# Altium project LimeSDR-X3_1v0.PrjPcb (part 1 of 19)
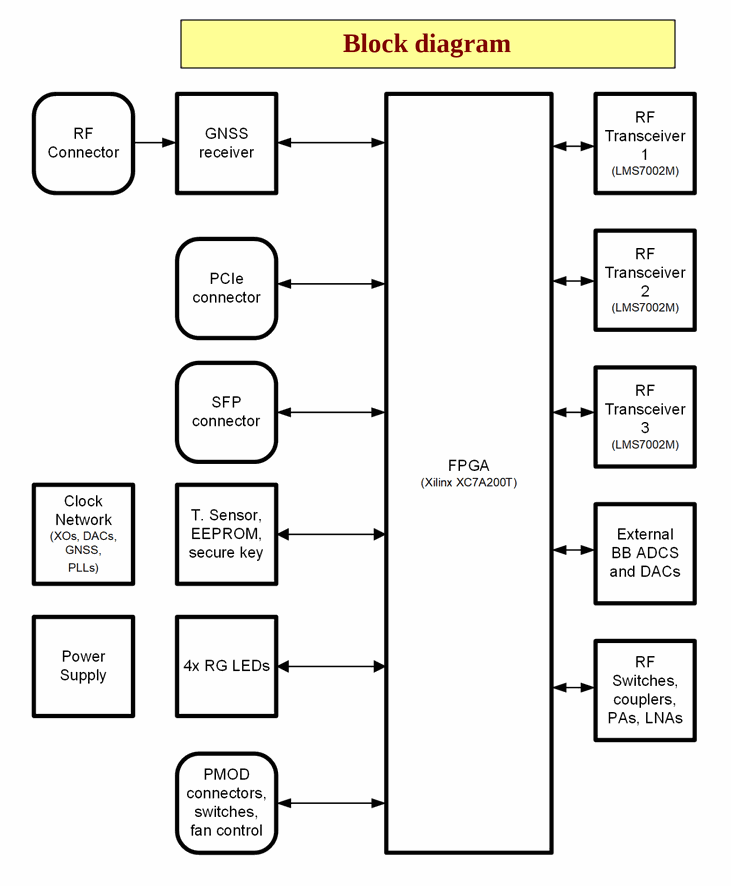
[diagram p0: 01_BlockDiagram.SchDoc]
31 sheets, 2073 parts. Net scope: global (net labels, ports and power ports of the same name join across sheets).
Board file: LimeSDR-X3_1v0.PcbDoc
Sheets:
  01_BlockDiagram.SchDoc
  02_PowerDiagram.SchDoc
  03_ClockDiagram.SchDoc
  04_RFDiagram.SchDoc
  05_LMS1_Misc.SchDoc
  06_LMS2_Misc.SchDoc
  07_LMS3_Misc.SchDoc
  08_LMS1_RF.SchDoc
  09_LMS2_RF.SchDoc
  10_LMS3_RF.SchDoc
  11_LMS1_Power.SchDoc
  12_LMS2_Power.SchDoc
  13_LMS3_Power.SchDoc
  14_LMS1_RF_PA.SchDoc
  15_LMS2_RF1_Misc.SchDoc
  16_LMS2_RF2_Misc.SchDoc
  17_FPGA_B12_B13_B14_B15.SchDoc
  18_FPGA_B16_B33_B34_B35.SchDoc
  19_FPGA_misc.SchDoc
  20_FPGA_Power.SchDoc
  21_Peripherals.SchDoc
  22_LMS2_TX_BB_DACs.SchDoc
  23_LMS2_RX1_BB_ADC.SchDoc
  24_LMS2_RX2_BB_ADC.SchDoc
  25_LMS3_RX1_BB_ADC.SchDoc
  26_LMS3_RX2_BB_ADC.SchDoc
  27_WR_PTP.SchDoc
  28_Clocks1.SchDoc
  29_Clocks2.SchDoc
  30_Power1.SchDoc
  31_Power2.SchDoc

## Sheet 01_BlockDiagram.SchDoc: Block diagram
size A4; Organization: Lime Microsystems; Address1: Surrey Tech Centre; Address2: Guildford GU2 7YG; Address3: Surrey; Address4: United Kingdom; Revision: v1.0; SheetNumber: 1; SheetTotal: 31

### Notes on the sheet
- Block diagram
- Project name:
- Title:
- Size:
- Date:
- A4
- Revision:
- Time:
- Sheet
- of
- File:

## Sheet 02_PowerDiagram.SchDoc: Power diagram
size A4; Organization: Lime Microsystems; Address1: Surrey Tech Centre; Address2: Guildford GU2 7YG; Address3: Surrey; Address4: United Kingdom; Revision: v1.0; SheetNumber: 2; SheetTotal: 31
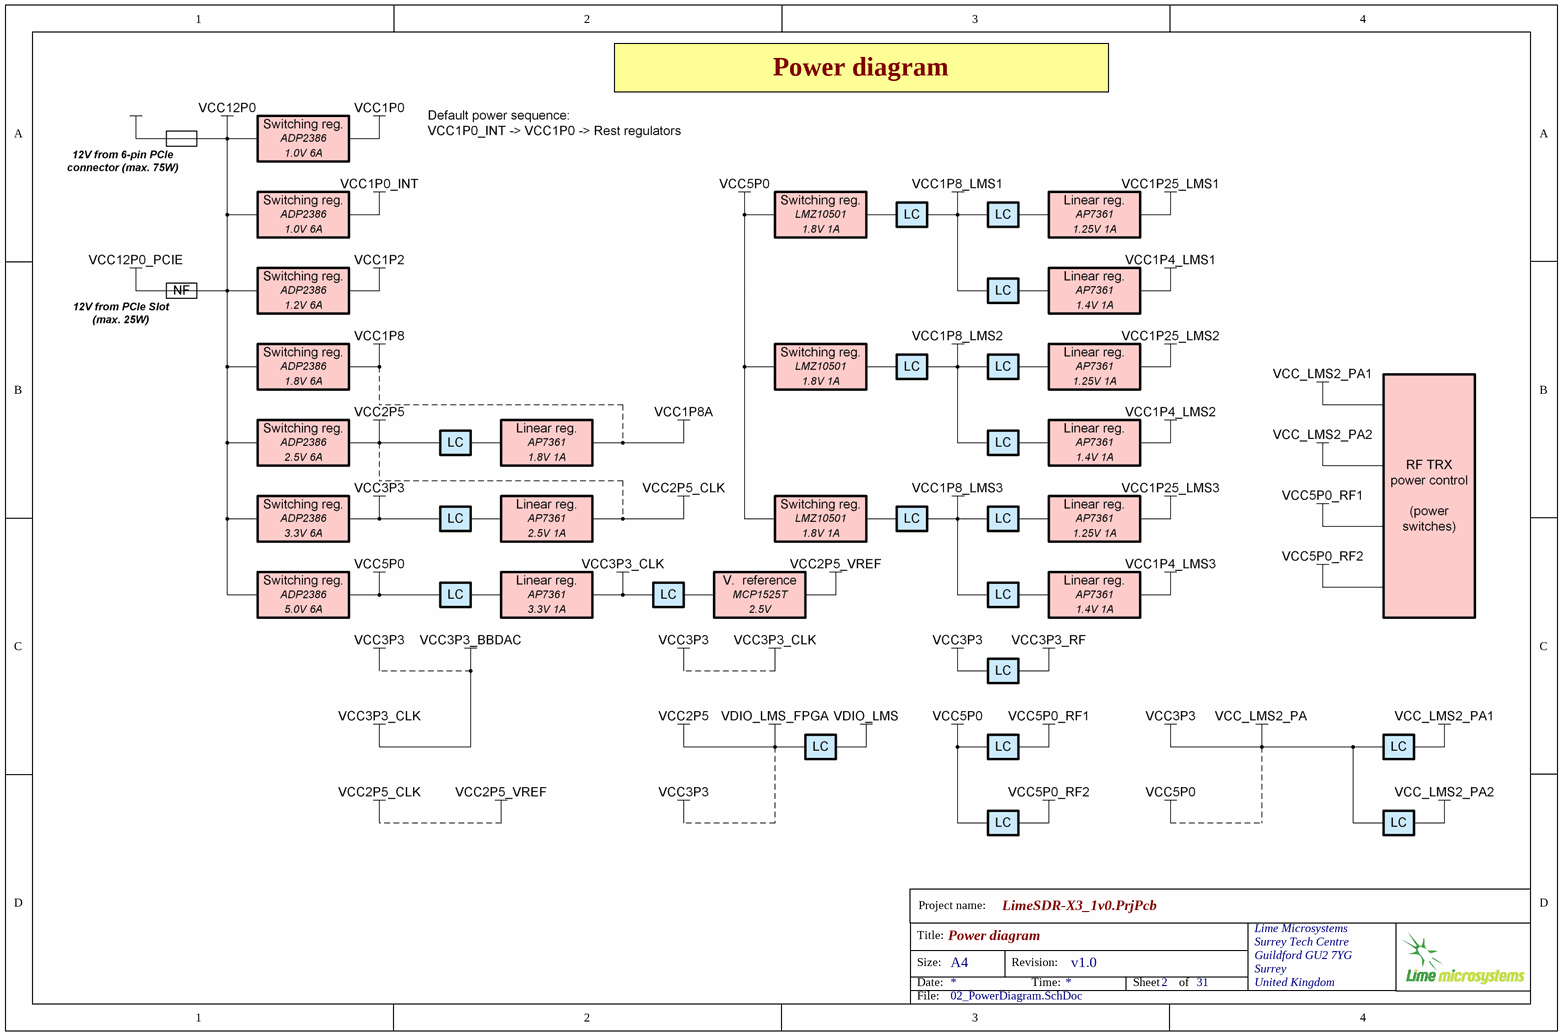
[diagram p1: 02_PowerDiagram.SchDoc]

### Notes on the sheet
- Power diagram
- Project name:
- Title:
- Size:
- Date:
- A4
- Revision:
- Time:
- Sheet
- of
- File:

## Sheet 03_ClockDiagram.SchDoc: Clock diagram
size A4; Organization: Lime Microsystems; Address1: Surrey Tech Centre; Address2: Guildford GU2 7YG; Address3: Surrey; Address4: United Kingdom; Revision: v1.0; SheetNumber: 3; SheetTotal: 31
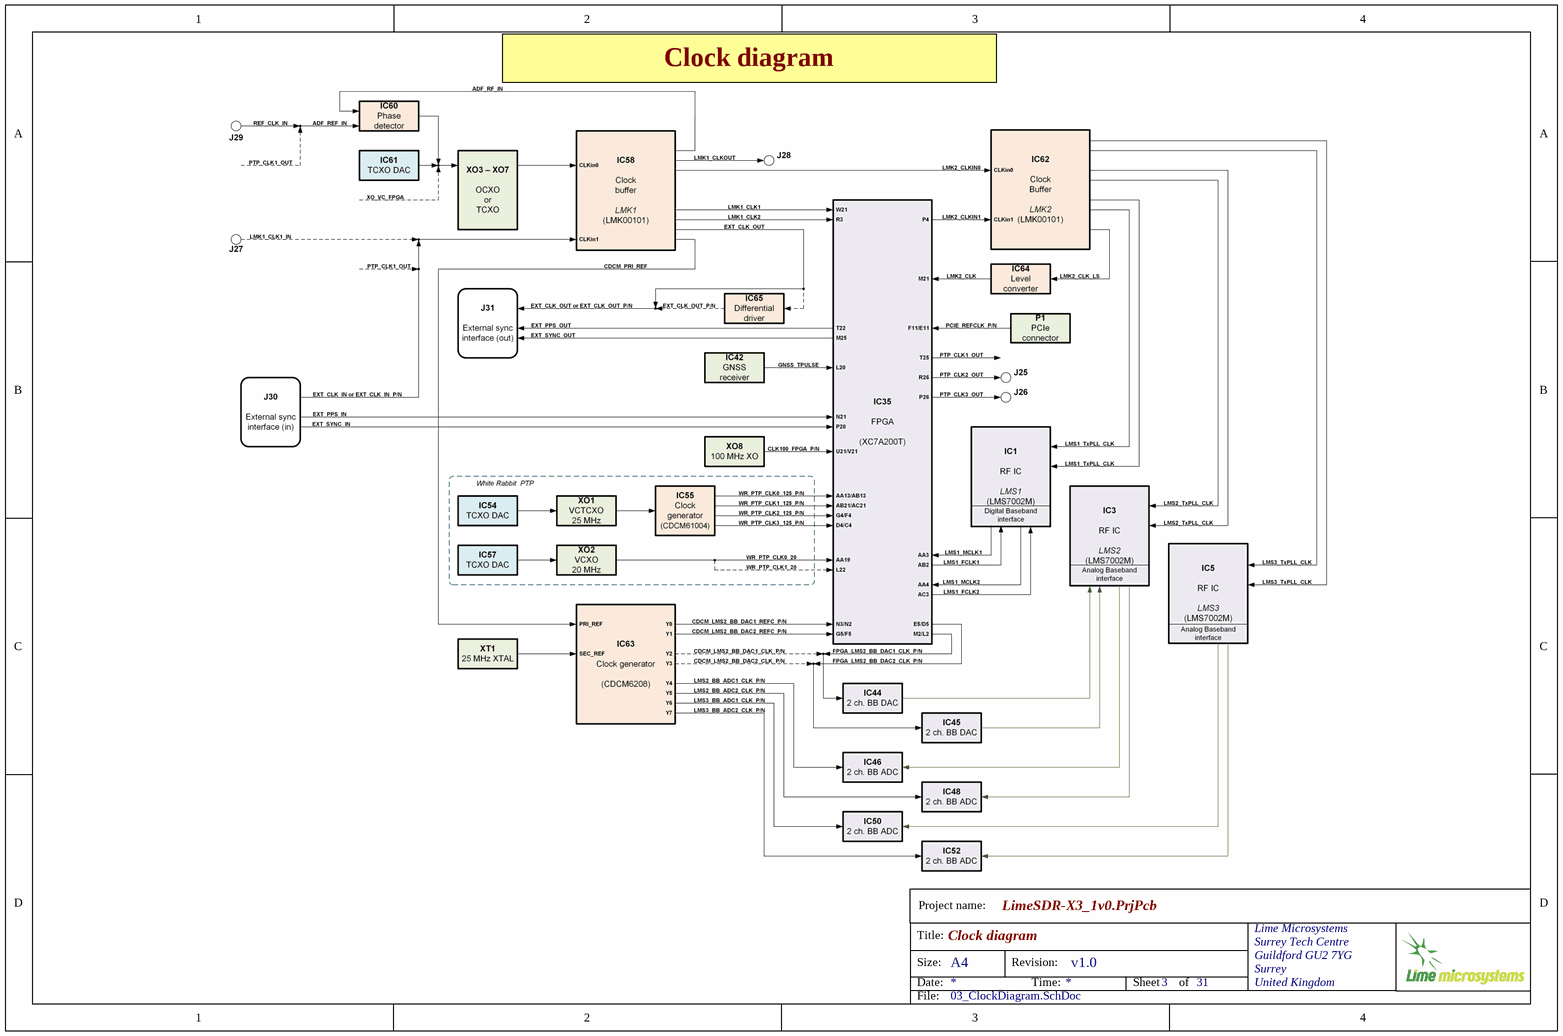
[diagram p2: 03_ClockDiagram.SchDoc]

### Notes on the sheet
- Clock diagram
- Project name:
- Title:
- Size:
- Date:
- A4
- Revision:
- Time:
- Sheet
- of
- File:

## Sheet 04_RFDiagram.SchDoc: RF diagram
size A4; Organization: Lime Microsystems; Address1: Surrey Tech Centre; Address2: Guildford GU2 7YG; Address3: Surrey; Address4: United Kingdom; Revision: v1.0; SheetNumber: 4; SheetTotal: 31
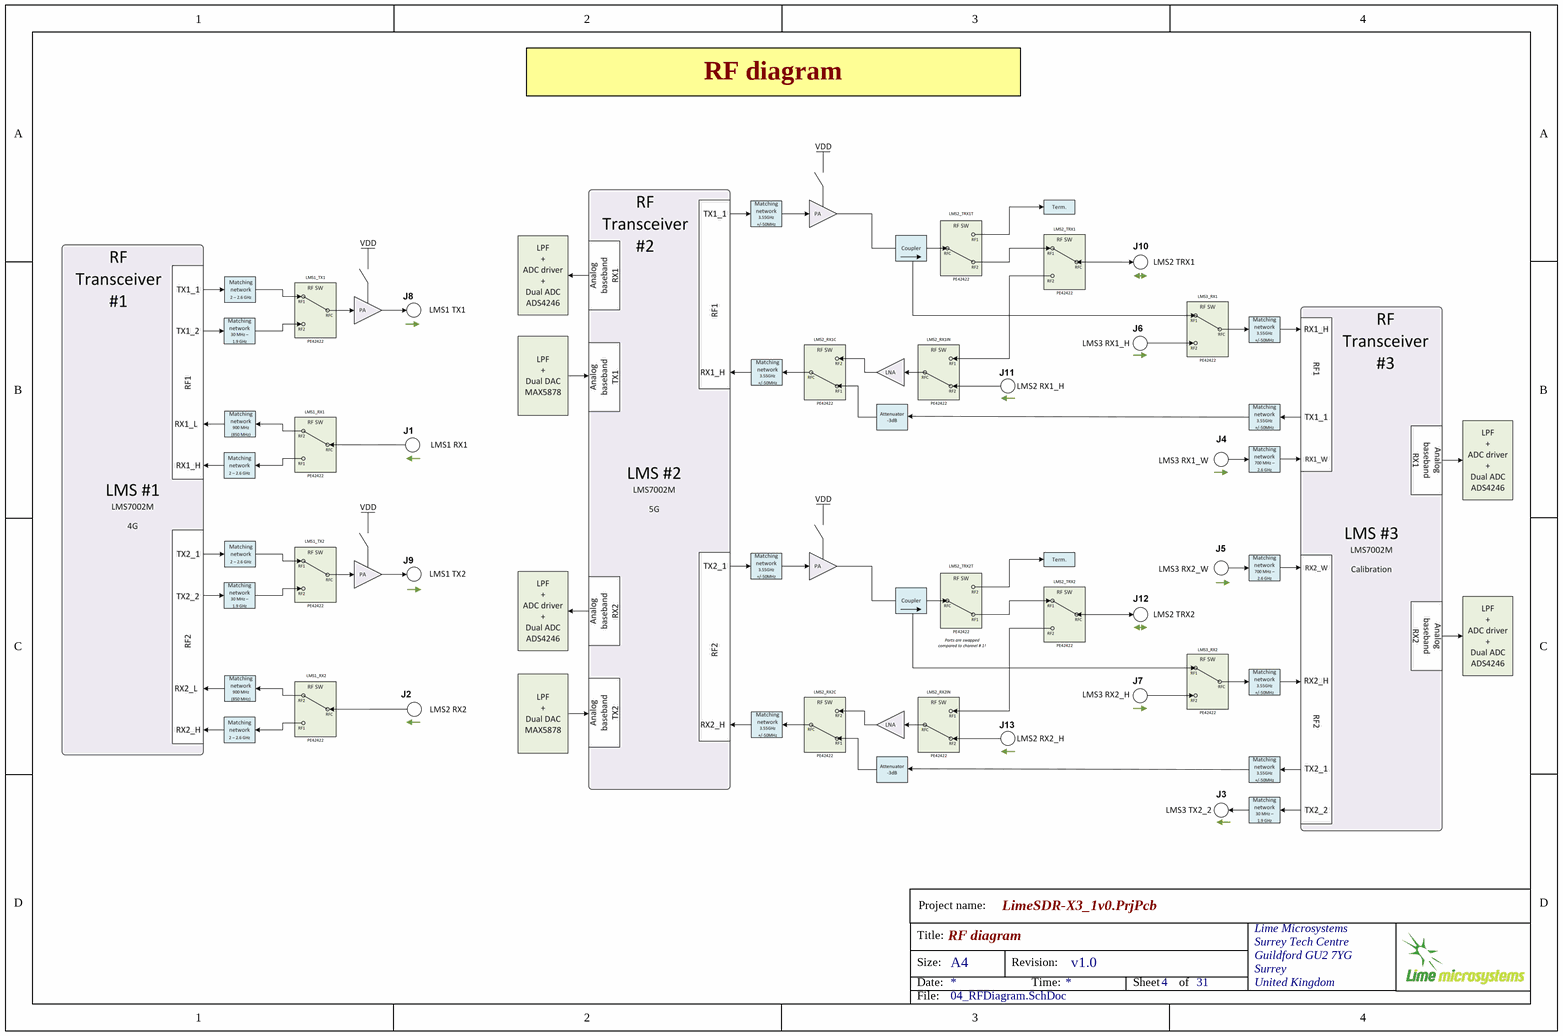
[diagram p3: 04_RFDiagram.SchDoc]

### Notes on the sheet
- RF diagram
- Project name:
- Title:
- Size:
- Date:
- A4
- Revision:
- Time:
- Sheet
- of
- File:

## Sheet 05_LMS1_Misc.SchDoc: LMS7002M misc (LMS1)
size A3; Organization: Lime Microsystems; Address1: Surrey Tech Centre; Address2: Guildford GU2 7YG; Address3: Surrey; Address4: United Kingdom; Revision: v1.0; SheetNumber: 5; SheetTotal: 31
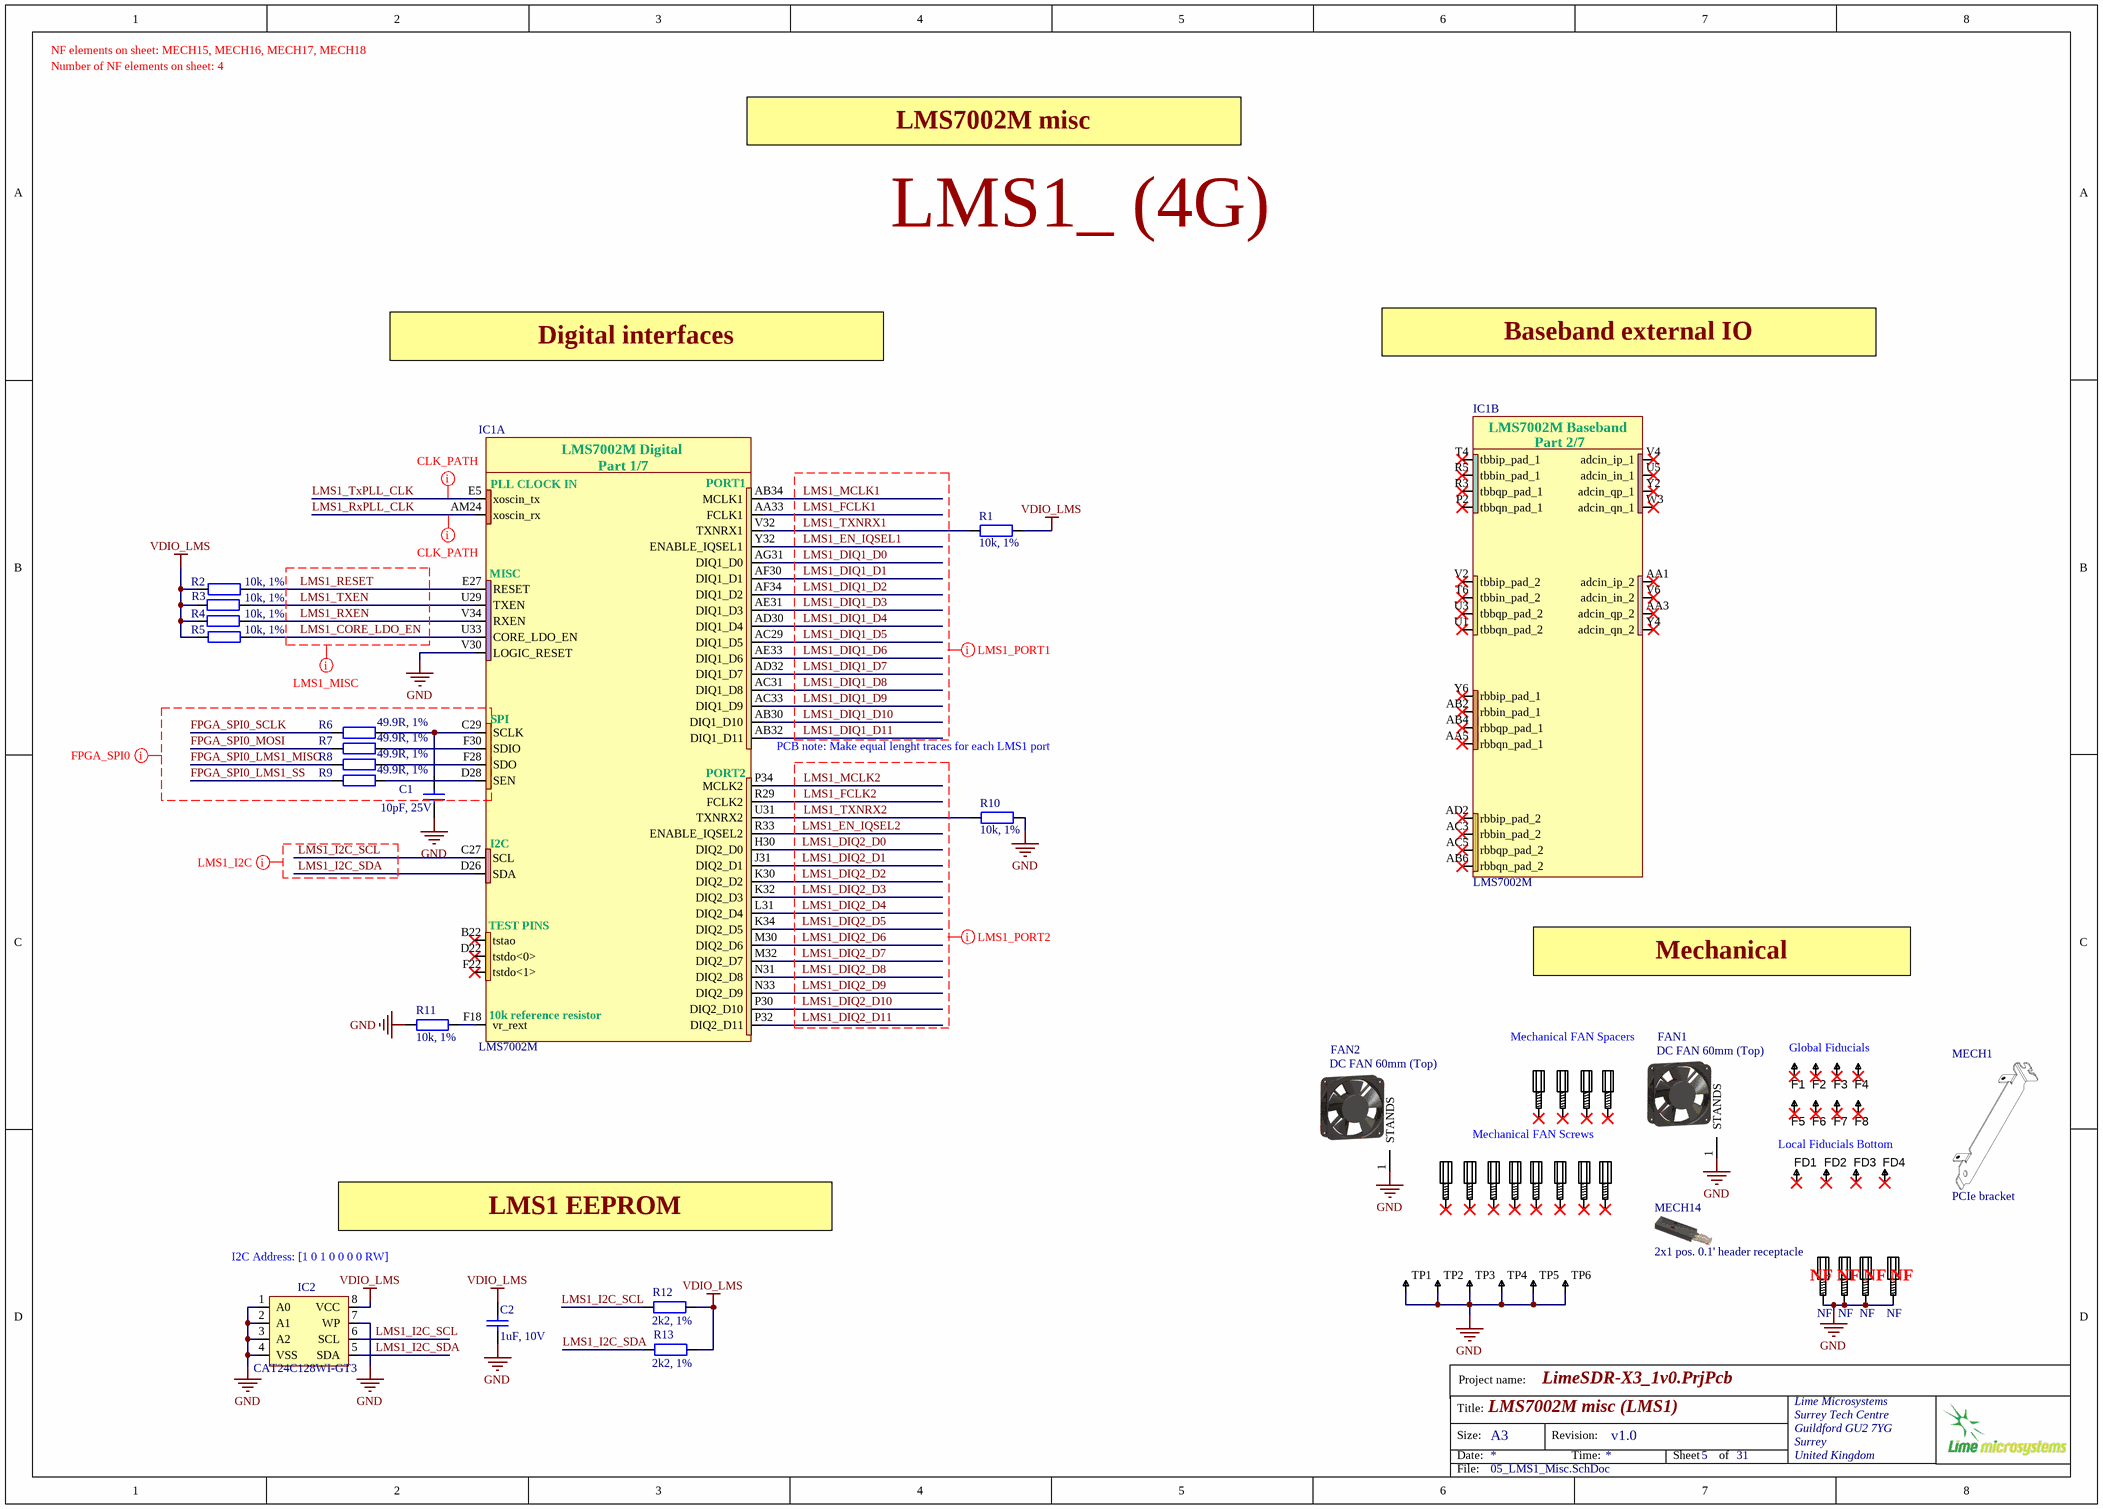
[diagram p4: 05_LMS1_Misc.SchDoc]

### Parts
C1  10pF, 25V  [CAP0402]
C2  1uF, 10V  [CAP0402]
F1  Fiducial  [Fiducial]  (value not drawn)
F2  Fiducial  [Fiducial]  (value not drawn)
F3  Fiducial  [Fiducial]  (value not drawn)
F4  Fiducial  [Fiducial]  (value not drawn)
F5  Fiducial  [Fiducial]  (value not drawn)
F6  Fiducial  [Fiducial]  (value not drawn)
F7  Fiducial  [Fiducial]  (value not drawn)
F8  Fiducial  [Fiducial]  (value not drawn)
FAN1  DC FAN 60mm (Top)  [FAN_60mm]
FAN2  DC FAN 60mm (Top)  [FAN_60mm]
FD1  Fiducial  [Fiducial_local]  (value not drawn)
FD2  Fiducial  [Fiducial_local]  (value not drawn)
FD3  Fiducial  [Fiducial_local]  (value not drawn)
FD4  Fiducial  [Fiducial_local]  (value not drawn)
IC1  LMS7002M  [LMS7002M_v5]  (parts A,B of 7)
IC2  CAT24C128WI-GT3  [SOIC127P600-8DL_v2]
MECH1  PCIe bracket  [PCIe_bracket]  (mechanical)
MECH2  Spacer M3  (value not drawn)  (mechanical)
MECH3  Spacer M3  (value not drawn)  (mechanical)
MECH4  Spacer M3  (value not drawn)  (mechanical)
MECH5  Spacer M3  (value not drawn)  (mechanical)
MECH6  Screws M3  (value not drawn)  (mechanical)
MECH7  Screws M3  (value not drawn)  (mechanical)
MECH8  Screws M3  (value not drawn)  (mechanical)
MECH9  Screws M3  (value not drawn)  (mechanical)
MECH10  Screws M3  (value not drawn)  (mechanical)
MECH11  Screws M3  (value not drawn)  (mechanical)
MECH12  Screws M3  (value not drawn)  (mechanical)
MECH13  Screws M3  (value not drawn)  (mechanical)
MECH14  2x1 pos. 0.1' header receptacle  (mechanical)
MECH15  Assembly Info: NF  [PCB_standoff]  (hidden comment: Standoff)
MECH16  Assembly Info: NF  [PCB_standoff]  (hidden comment: Standoff)
MECH17  Assembly Info: NF  [PCB_standoff]  (hidden comment: Standoff)
MECH18  Assembly Info: NF  [PCB_standoff]  (hidden comment: Standoff)
R1  10k, 1%  [RES0402]
R2  10k, 1%  [RES0402]
R3  10k, 1%  [RES0402]
R4  10k, 1%  [RES0402]
R5  10k, 1%  [RES0402]
R6  49.9R, 1%  [RES0402]
R7  49.9R, 1%  [RES0402]
R8  49.9R, 1%  [RES0402]
R9  49.9R, 1%  [RES0402]
R10  10k, 1%  [RES0402]
R11  10k, 1%  [RES0402]
R12  2k2, 1%  [RES0402]
R13  2k2, 1%  [RES0402]
TP1  TESTPOINT_THT_MINI  [TP-SMD-LOW_PROFILE]  (value not drawn)
TP2  TESTPOINT_THT_MINI  [TP-SMD-LOW_PROFILE]  (value not drawn)
TP3  TESTPOINT_THT_MINI  [TP-SMD-LOW_PROFILE]  (value not drawn)
TP4  TESTPOINT_THT_MINI  [TP-SMD-LOW_PROFILE]  (value not drawn)
TP5  TESTPOINT_THT_MINI  [TP-SMD-LOW_PROFILE]  (value not drawn)
TP6  TESTPOINT_THT_MINI  [TP-SMD-LOW_PROFILE]  (value not drawn)

### Nets
GND: C1.2 C2.2 FAN1.1(STANDS) FAN2.1(STANDS) IC1.V30(LOGIC_RESET) IC2.1(A0) IC2.2(A1) IC2.3(A2) IC2.4(VSS) IC2.7(WP) MECH15.MH1 MECH16.MH1 MECH17.MH1 MECH18.MH1 R10.1 R11.2 TP1.1 TP2.1 TP3.1 TP4.1 TP5.1 TP6.1
VDIO_LMS: C2.1 IC2.8(VCC) R1.2 R2.2 R3.1 R4.1 R5.2 R12.1 R13.1
FPGA_SPI0_LMS1_MISO: R8.2
FPGA_SPI0_LMS1_SS: R9.2
FPGA_SPI0_MOSI: R7.2
FPGA_SPI0_SCLK: R6.2
LMS1_CORE_LDO_EN: IC1.U33(CORE_LDO_EN) R5.1
LMS1_DIQ1_D0: IC1.AG31(DIQ1_D0)
LMS1_DIQ1_D1: IC1.AF30(DIQ1_D1)
LMS1_DIQ1_D2: IC1.AF34(DIQ1_D2)
LMS1_DIQ1_D3: IC1.AE31(DIQ1_D3)
LMS1_DIQ1_D4: IC1.AD30(DIQ1_D4)
LMS1_DIQ1_D5: IC1.AC29(DIQ1_D5)
LMS1_DIQ1_D6: IC1.AE33(DIQ1_D6)
LMS1_DIQ1_D7: IC1.AD32(DIQ1_D7)
LMS1_DIQ1_D8: IC1.AC31(DIQ1_D8)
LMS1_DIQ1_D9: IC1.AC33(DIQ1_D9)
LMS1_DIQ1_D10: IC1.AB30(DIQ1_D10)
LMS1_DIQ1_D11: IC1.AB32(DIQ1_D11)
LMS1_DIQ2_D0: IC1.H30(DIQ2_D0)
LMS1_DIQ2_D1: IC1.J31(DIQ2_D1)
LMS1_DIQ2_D2: IC1.K30(DIQ2_D2)
LMS1_DIQ2_D3: IC1.K32(DIQ2_D3)
LMS1_DIQ2_D4: IC1.L31(DIQ2_D4)
LMS1_DIQ2_D5: IC1.K34(DIQ2_D5)
LMS1_DIQ2_D6: IC1.M30(DIQ2_D6)
LMS1_DIQ2_D7: IC1.M32(DIQ2_D7)
LMS1_DIQ2_D8: IC1.N31(DIQ2_D8)
LMS1_DIQ2_D9: IC1.N33(DIQ2_D9)
LMS1_DIQ2_D10: IC1.P30(DIQ2_D10)
LMS1_DIQ2_D11: IC1.P32(DIQ2_D11)
LMS1_EN_IQSEL1: IC1.Y32(ENABLE_IQSEL1)
LMS1_EN_IQSEL2: IC1.R33(ENABLE_IQSEL2)
LMS1_FCLK1: IC1.AA33(FCLK1)
LMS1_FCLK2: IC1.R29(FCLK2)
LMS1_I2C_SCL: IC1.C27(SCL) IC2.6(SCL) R12.2
LMS1_I2C_SDA: IC1.D26(SDA) IC2.5(SDA) R13.2
LMS1_MCLK1: IC1.AB34(MCLK1)
LMS1_MCLK2: IC1.P34(MCLK2)
LMS1_RESET: IC1.E27(RESET) R2.1
LMS1_RXEN: IC1.V34(RXEN) R4.2
LMS1_RxPLL_CLK: IC1.AM24(xoscin_rx)
LMS1_TXEN: IC1.U29(TXEN) R3.2
LMS1_TXNRX1: IC1.V32(TXNRX1) R1.1
LMS1_TXNRX2: IC1.U31(TXNRX2) R10.2
LMS1_TxPLL_CLK: IC1.E5(xoscin_tx)
NetC1_1: C1.1 IC1.C29(SCLK) R6.1
NetIC1_D28: IC1.D28(SEN) R9.1
NetIC1_F18: IC1.F18(vr_rext) R11.1
NetIC1_F28: IC1.F28(SDO) R8.1
NetIC1_F30: IC1.F30(SDIO) R7.1

Not connected (* = marked no-connect by the designer): F1 1*; F2 1*; F3 1*; F4 1*; F5 1*; F6 1*; F7 1*; F8 1*; FD1 1*; FD2 1*; FD3 1*; FD4 1*; IC1 AA1(adcin_ip_2)* AA3(adcin_qp_2)* AA5(rbbqn_pad_1)* AB2(rbbin_pad_1)* AB4(rbbqp_pad_1)* AB6(rbbqn_pad_2)* AC3(rbbin_pad_2)* AC5(rbbqp_pad_2)* AD2(rbbip_pad_2)* B22(tstao)* D22(tstdo<0>)* F22(tstdo<1>)* P2(tbbqn_pad_1)* R3(tbbqp_pad_1)* R5(tbbin_pad_1)* T4(tbbip_pad_1)* T6(tbbin_pad_2)* U1(tbbqn_pad_2)* U3(tbbqp_pad_2)* U5(adcin_in_1)* V2(tbbip_pad_2)* V4(adcin_ip_1)* V6(adcin_in_2)* W3(adcin_qn_1)* Y2(adcin_qp_1)* Y4(adcin_qn_2)* Y6(rbbip_pad_1)*; MECH2 MH1*; MECH3 MH1*; MECH4 MH1*; MECH5 MH1*; MECH6 MH1*; MECH7 MH1*; MECH8 MH1*; MECH9 MH1*; MECH10 MH1*; MECH11 MH1*; MECH12 MH1*; MECH13 MH1*

### Layout directives
net class CLK_PATH: LMS1_RxPLL_CLK, LMS1_TxPLL_CLK
net class FPGA_SPI0: FPGA_SPI0_LMS1_MISO, FPGA_SPI0_LMS1_SS, FPGA_SPI0_MOSI, FPGA_SPI0_SCLK
net class LMS1_I2C: LMS1_I2C_SCL, LMS1_I2C_SDA
net class LMS1_PORT2: LMS1_DIQ2_D0, LMS1_DIQ2_D1, LMS1_DIQ2_D2, LMS1_DIQ2_D3, LMS1_DIQ2_D4, LMS1_DIQ2_D5, LMS1_DIQ2_D6, LMS1_DIQ2_D7, LMS1_DIQ2_D8, LMS1_DIQ2_D9, LMS1_DIQ2_D10, LMS1_DIQ2_D11, LMS1_EN_IQSEL2, LMS1_FCLK2, LMS1_MCLK2, LMS1_TXNRX2
net class LMS1_PORT1: LMS1_DIQ1_D0, LMS1_DIQ1_D1, LMS1_DIQ1_D2, LMS1_DIQ1_D3, LMS1_DIQ1_D4, LMS1_DIQ1_D5, LMS1_DIQ1_D6, LMS1_DIQ1_D7, LMS1_DIQ1_D8, LMS1_DIQ1_D9, LMS1_DIQ1_D10, LMS1_DIQ1_D11, LMS1_EN_IQSEL1, LMS1_FCLK1, LMS1_MCLK1, LMS1_TXNRX1
net class LMS1_MISC: LMS1_CORE_LDO_EN, LMS1_RESET, LMS1_RXEN, LMS1_TXEN

### Notes on the sheet
- NF elements on sheet: MECH15, MECH16, MECH17, MECH18
- Number of NF elements on sheet: 4
- LMS7002M misc
- LMS1_ (4G)
- Digital interfaces
- Baseband external IO
- (near IC1) PCB note: Make equal lenght traces for each LMS1 port
- Mechanical
- Mechanical FAN Spacers
- Global Fiducials
- Mechanical FAN Screws
- Local Fiducials Bottom
- (near IC2) I2C Address: [1 0 1 0 0 0 0 RW]
- LMS1 EEPROM
- NF
- Project name:
- Title:
- Size:
- Date:
- A3
- Revision:
- Time:
- Sheet
- of
- File:
- (in symbol LMS7002Mr4, part A) LMS7002M Digital; Part 1/7; PLL CLOCK IN; PORT1; MISC; SPI; PORT2; I2C; TEST PINS; 10k reference resistor
- (in symbol LMS7002Mr4, part B) LMS7002M Baseband; Part 2/7

### Library data of the parts
C1 = Cap_0402: Manufacturer Part Number 1: 04023A100JAT2A; Manufacturer: AVX; Part Description: 10pF ±5% 25V C0G, NP0 Ceramic Capacitor -55°C ~ 125°C Surface Mount, MLCC 0402 (1005 Metric) 0.039" L x 0.020" W (1.00mm x 0.50mm); Capacitance Tolerance: ± 5%; Voltage Rating: 25; Ceramic Capacitor Case: 0402 [1005 Metric]; Capacitor Case Style: 0402 [1005 Metric]<!--FANDB--><div class="features-and-benefits-container"></div>; Dielectric Characteristic: C0G / NP0; SVHC: No SVHC (16-Jun-2014); Capacitance: 10; Value: 10pF, 25V; Supplier 1: Farnell; Supplier Part Number 1: 2332478RL; Product Range: -; RoHS: YES; Operating Temperature Min: -55; Operating Temperature Max: 125; Capacitance Tolerance ±: ± 5%; MSL: MSL 1 - Unlimited; Packaging: Cut Tape
C2 = Cap_0402: Manufacturer Part Number 1: C1005X5R1E105K050BC; Manufacturer: TDK; Part Description: 1µF ±10% 10V X5R Ceramic Capacitor -55°C ~ 85°C Surface Mount, MLCC 0402 (1005 Metric) 0.039" L x 0.020" W (1.00mm x 0.50mm); Voltage Rating: 10; Capacitance Tolerance: ± 10%; Product Range: TDK - C Series; Ceramic Capacitor Case: 0402 [1005 Metric]; Capacitance: 1; Dielectric Characteristic: X6; Value: 1uF, 10V; Supplier 1: Digi-Key; Supplier Part Number 1: 445-9066-1-ND; MSL: -; RoHS: YES
FAN1 FAN2 = 12V_DC_FAN: Part Description: Fan Tubeaxial 12VDC Square - 60mm L x 60mm H Vapo-Bearing™ 12.7 CFM (0.356m³/min) 2 Wire Leads; Manufacturer: Sunon; Manufacturer Part Number 1: HA60151V4-1000U-A99; ComponentLink1URL: http://www.orionfans.com/media/parts/dcfans/OD6025%20Final.pdf; ComponentLink1Description: http://www.orionfans.com/media/parts/dcfans/OD6025%20Final.pdf; Supplier 1: Digi-Key; Supplier Part Number 1: 259-1792-ND; Stock 1: 93; Pricing 1: 1=6,04000, 10=5,53300, 25=5,03000, 50=4,65260, 100=4,14960, 250=3,96096, 500=3,70948 (USD); RoHS: Yes; ComponentLink2URL: http://www.sunon.com/uFiles/file/03_products/08-catalog%20download/Sunon%20DC%20Brushless%20Fan%20&amp;%20Blower_(240-E).pdf?src-supplier=Digi-Key; ComponentLink2Description: http://www.sunon.com/uFiles/file/03_products/08-catalog%20download/Sunon%20DC%20Brushless%20Fan%20&amp;%20Blower_(240-E).pdf?src-supplier=Digi-Key
IC1 = LMS7002Mr4: Schematic symbol revision 4. Default footprint - 0.31mm pad; Manufacturer: Lime Microsystems; Part Description: IC FPRF Transceiver LMS7002M; 261 pin aQFN; Supplier 1: Lime Microsystems; Supplier Part Number 1: LMS7002M; Manufacturer Part Number 1: LMS7002M
IC2 = 24FC64F: Part Description: EEPROM Memory IC 128Kb (16K x 8) I²C 1MHz 400ns 8-SOIC; Manufacturer: ON Semiconductor; Memory Type: Non-Volatile; Memory Format: EEPROM; Memory Size: 128Kb (16K x 8); Write Cycle Time - Word, Page: 5ms; Memory Interface: I²C; Voltage - Supply: 1.8 V ~ 5.5 V; Supplier 1: Digi-Key; Supplier Part Number 1: CAT24C128WI-GT3CT-ND; Manufacturer Part Number 1: CAT24C128WI-GT3; RoHS: RoHS Compliant; Category: Integrated Circuits (ICs); Stock 1: 14804; Pricing 1: 1=0.31, 10=0.309, 100=0.2532, 500=0.24616, 1000=0.23956 (USD); Packaging: Cut Tape (CT); Part Status: Active; Technology: EEPROM; Operating Temperature: -40°C ~ 85°C (TA); Mounting Type: Surface Mount; Package / Case: 8-SOIC (0.154", 3.90mm Width); Supplier Device Package: 8-SOIC; Base Part Number: CAT24C128; ComponentLink1URL: http://www.onsemi.com/pub/Collateral/CAT24C128-D.PDF; ComponentLink1Description: http://www.onsemi.com/pub/Collateral/CAT24C128-D.PDF
MECH1 = PCIe_bracket: Part Description: BRACKET COMPUTER EISA/ISA OR PCI; Manufacturer: Keystone Electronics; Manufacturer Part Number 1: 9200; Body Material: Steel; ComponentLink1URL: http://www.keyelco.com/product-pdf.cfm?p=2468; ComponentLink1Description: http://www.keyelco.com/product-pdf.cfm?p=2468; Supplier 1: Digi-Key; Supplier Part Number 1: 36-9200-ND; Stock 1: 36909; Pricing 1: 1=2,08000, 10=1,88700, 50=1,69400, 250=1,46300, 1000=1,34000, 2500=1,16000, 5000=1,02410 (USD); RoHS: Yes; Mount: Brackets; Material: Steel; Package Quantity: 1; Packaging: Bulk; Length: 120.02mm; Width: 0.725inch; REACH SVHC: No SVHC; ComponentLink2URL: https://datasheet.ciiva.com/1624/88095-1624695.pdf?src-supplier=Element14; ComponentLink2Description: https://datasheet.ciiva.com/1624/88095-1624695.pdf?src-supplier=Element14; ComponentLink3URL: https://datasheet.ciiva.com/4667/9200-292546-4667239.pdf?src-supplier=Mouser; ComponentLink3Description: https://datasheet.ciiva.com/4667/9200-292546-4667239.pdf?src-supplier=Mouser; ComponentLink4URL: https://datasheet.ciiva.com/18415/70183120-18415751.pdf?src-supplier=Allied+Electronics; ComponentLink4Description: https://datasheet.ciiva.com/18415/70183120-18415751.pdf?src-supplier=Allied+Electronics
MECH2-MECH5 = STANDOFF_M-F_THREADED_M3x8x10mm_HEX_5mm dia: STANDOFF M/F MET 5MM HEX 10MM L; Manufacturer: BOSSARD; Manufacturer Part Number 1: TDYSFF-M3/10; Part Description: Screwed spacer sleeve; Int.thread: M3; 25mm; brass; Supplier 1: TME; Supplier Part Number 1: TDYSFF-M3/10
MECH6-MECH13 = STANDOFF_M-F_THREADED_M3x8x10mm_HEX_5mm dia: STANDOFF M/F MET 5MM HEX 10MM L; Manufacturer: BOSSARD; Manufacturer Part Number 1: 1003755; Part Description: Screw; M3x6; DIN:912; Head: cheese head; imbus; steel; zinc; Supplier 1: TME; Supplier Part Number 1: 1003755
MECH14 = Header_1x2_receptacle: Part Description: 2 Position Rectangular Receptacle Connector IDC Gold 24 AWG; Manufacturer: Molex; Manufacturer Part Number 1: 0014562021; Contact Resistance: 15mR; Max Voltage Rating (DC): 250.25kV; Current Rating: 3A; Voltage Rating: 250V; Connector Type: Receptacle,Socket,IDC; Number of Positions: 2; Wire/Cable Type: Discrete,Ribbon; Wire/Cable Gauge: 24AWG; Pitch: 2.54mm; Glow Wire Compliant: Non-compliant; Supplier 1: Digi-Key; Supplier Part Number 1: 23-0014562021-ND; Stock 1: 5637; Pricing 1: 2=0,78000, 10=0,68600, 26=0,64577, 50=0,61880, 100=0,59180, 250=0,53800, 500=0,48420, 1000=0,43040, 2500=0,39005 (USD); RoHS: Yes; Mount: Free Hanging,Cable; Contact Plating: Gold; Contact Material: Bronze; Color: Black; Housing Color: Black; Housing Material: Polyester; Min Operating Temperature: -40°C; Max Operating Temperature: 105°C; Number of Rows: 1; Contact Gender: Female; Package Quantity: 1; Packaging: Rail/Tube; Termination: IDT; Number of Contacts: 2; Orientation: Straight; Number of Circuits: 2; Length: 5.05mm; Height: 15.2mm; Width: 2.51mm; Lead Free: Lead Free; ComponentLink1URL: https://datasheet.ciiva.com/5162/0014562021-rb-cbl-wr-trp-conn-156807-5162409.pdf?src-supplier=Mouser; ComponentLink1Description: https://datasheet.ciiva.com/5162/0014562021-rb-cbl-wr-trp-conn-156807-5162409.pdf?src-supplier=Mouser; ComponentLink2URL: https://datasheet.ciiva.com/702/014562021-sd-702522.pdf?src-supplier=Digi-Key; ComponentLink2Description: https://datasheet.ciiva.com/702/014562021-sd-702522.pdf?src-supplier=Digi-Key; ComponentLink3URL: https://datasheet.ciiva.com/30109/85530014562021-rb-cbl-wr-trp-n-30109738.pdf?src-supplier=Onlinecomponents.com; ComponentLink3Description: https://datasheet.ciiva.com/30109/85530014562021-rb-cbl-wr-trp-n-30109738.pdf?src-supplier=Onlinecomponents.com
MECH15-MECH18 = STANDOFF_M-F_THREADED_M3x8x10mm_HEX_5mm dia: STANDOFF M/F MET 5MM HEX 10MM L; Manufacturer: FIX&FASTEN; Manufacturer Part Number 1: FIX-MAE-5TV; Part Description: PCB distance; polyamide; L:5mm; Colour: natural; Øcutout:3mm; Unit: pcs; SuppliedAmount: 1000; MinAmount: 10; Type of spacer: PCB distance; Panel cutout diameter: 3mm; Spanner size: 5.5mm; Internal thread: M3; Thread pitch: 0,5; Supplier 1: TME; Supplier Part Number 1: FIX-MAE-5TV; Category: Plastic Pegs; Weight: 0.145; Multiples: 10; Material: polyamide; Spacer length: 5mm; Price Type: NET
R1-R5 R10 R11 = Res_0402: Manufacturer: Yageo; Manufacturer Part Number 1: RC0402FR-0710KL; Part Description: RES SMD 10K OHM 1% 1/16W 0402; Temperature Coefficient: ±100ppm/°C; Power (Watts): 0.063W, 1/16W; Value: 10k, 1%; Supplier 1: Digi-Key; Supplier Part Number 1: 311-10.0KLRTR-ND; Resistance (Ohms): 10k; Packaging: Tape & Reel (TR); RoHS: RoHS Compliant; Package / Case: 0402 (1005 Metric); Tolerance: ±1%; Operating Temperature: -55°C ~ 155°C; Size / Dimension: 0.039" L x 0.020" W (1.00mm x 0.50mm); Number of Terminations: 2; Category: Resistors; Height: 0.016" (0.40mm); Supplier Device Package: 0402; Features: Moisture Resistant; Composition: Thick Film
R6-R9 = Res_0402: Manufacturer: Samsung Electro-Mechanics America, Inc.; Manufacturer Part Number: RC1005F49R9CS; Part Description: RES SMD 49.9 OHM 1% 1/16W 0402; Temperature Coefficient: ±100ppm/°C; Resistance (Ohms): 49.9; Power (Watts): 0.063W, 1/16W; Number of Terminations: 2; Size / Dimension: 0.039" L x 0.020" W (1.00mm x 0.50mm); Supplier Device Package: 0402 (1005 Metric); RoHS: RoHS Compliant; Supplier Part Number 1: 1276-3469-6-ND; Features: -; Packaging: Digi-Reel®; Tolerance: ±1%; Height: 0.016" (0.40mm); Category: Resistors; Composition: Thick Film; Package / Case: 0402 (1005 Metric); Supplier 1: Digi-Key; Operating Temperature: -55°C ~ 155°C; Value: 49.9R, 1%; Manufacturer Part Number 1: RC1005F49R9CS
R12 R13 = Res_0402: Manufacturer: Stackpole Electronics Inc; Manufacturer Part Number 1: RMCF0402FT2K20; Part Description: RES SMD 2.2K OHM 1% 1/16W 0402; Resistance (Ohms): 2.2k; Temperature Coefficient: ±100ppm/°C; Power (Watts): 0.063W, 1/16W; Value: 2k2, 1%; Supplier 1: Digi-Key; Supplier Part Number 1: RMCF0402FT2K20CT-ND; Supplier Device Package: 0402; Package / Case: 0402 (1005 Metric); Size / Dimension: 0.039" L x 0.020" W (1.00mm x 0.50mm); Operating Temperature: -55°C ~ 155°C; Composition: Thick Film; Category: Resistors; Features: -; Height: 0.016" (0.40mm); RoHS: RoHS Compliant; Number of Terminations: 2; Packaging: Cut Tape (CT); Tolerance: ±1%
TP1-TP6 = TESTPOINT_THT_MINI: Test Point PCB mount Miniature White; Manufacturer Part Number 1: S1751-46R; Manufacturer: Harwin Inc; Part Description: Natural PC Test Point 0.128" x 0.065" x 0.079" (3.25mm x 1.65mm x 2.00mm) Brass, Tin Plating Surface Mount Mounting Type; Supplier 1: Digi-Key; Supplier Part Number 1: 952-1478-2-ND; RoHS: RoHS Compliant; Color: Natural; Material: Copper Alloy; Mounting Type: Surface Mount; Terminal: 0.128" x 0.065" x 0.079" (3.25mm x 1.65mm x 2.00mm) Brass, Tin Plated; Type: PC Test Point; Packaging: Tape & Reel (TR); Category: Test and Measurement

## Sheet 06_LMS2_Misc.SchDoc: LMS7002M misc (LMS2)
size A3; Organization: Lime Microsystems; Address1: Surrey Tech Centre; Address2: Guildford GU2 7YG; Address3: Surrey; Address4: United Kingdom; Revision: v1.0; SheetNumber: 6; SheetTotal: 31
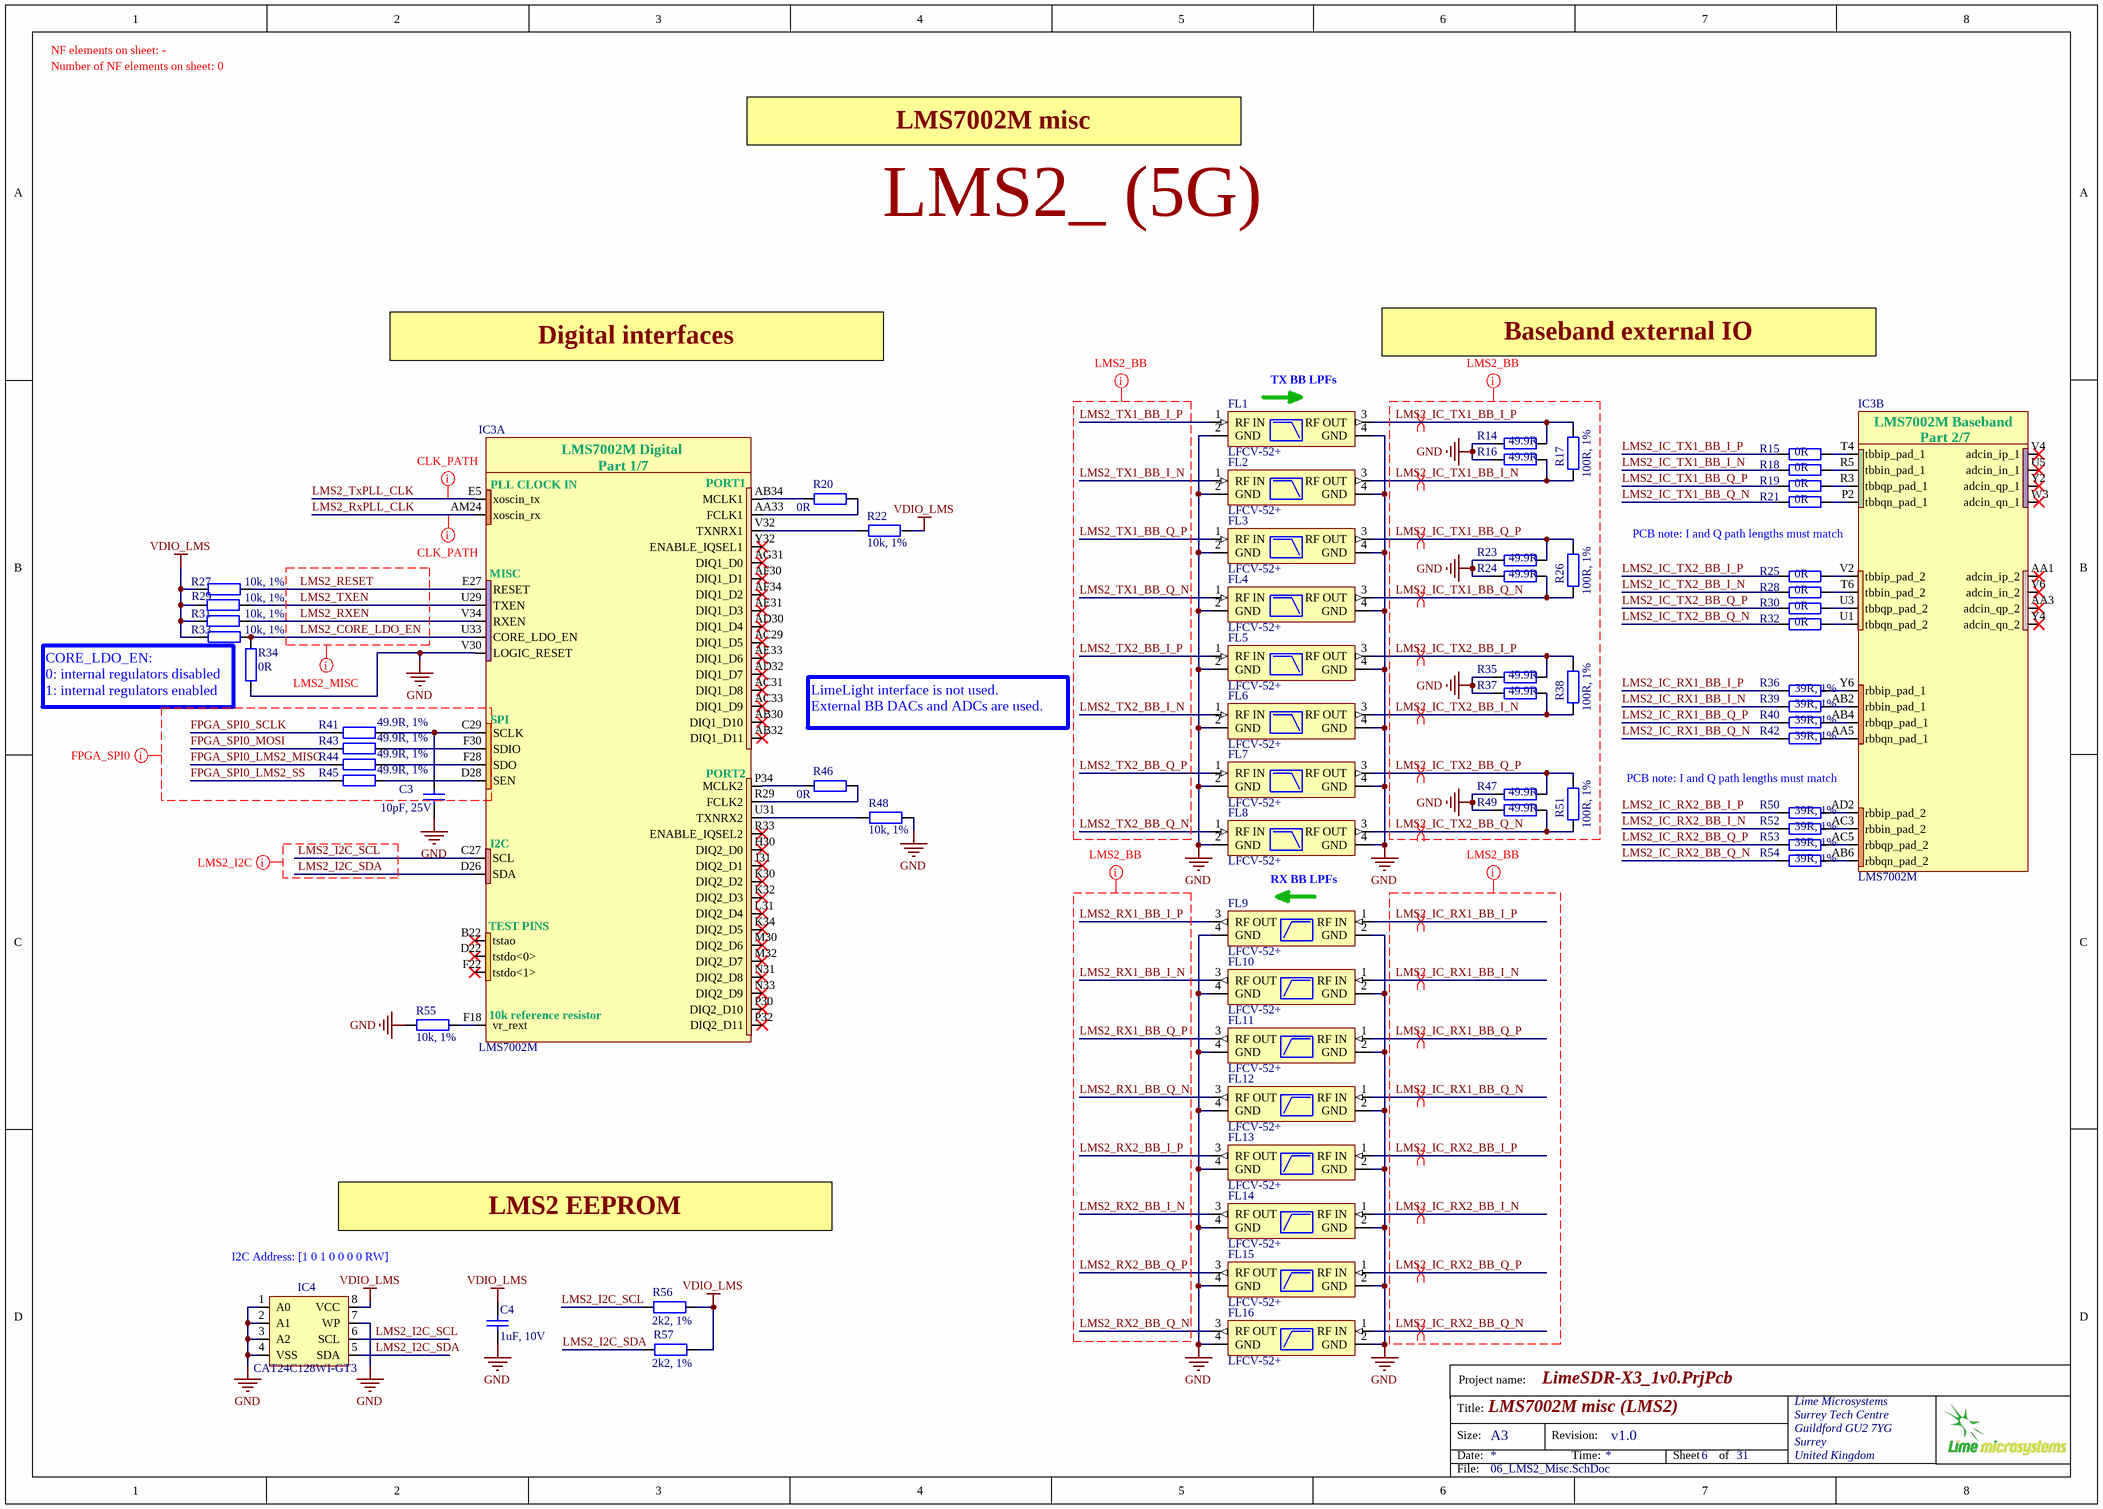
[diagram p5: 06_LMS2_Misc.SchDoc]

### Parts
C3  10pF, 25V  [CAP0402]
C4  1uF, 10V  [CAP0402]
FL1  LFCV-52+  [LFCV-52+_LPF_v2]
FL2  LFCV-52+  [LFCV-52+_LPF_v2]
FL3  LFCV-52+  [LFCV-52+_LPF_v2]
FL4  LFCV-52+  [LFCV-52+_LPF_v2]
FL5  LFCV-52+  [LFCV-52+_LPF_v2]
FL6  LFCV-52+  [LFCV-52+_LPF_v2]
FL7  LFCV-52+  [LFCV-52+_LPF_v2]
FL8  LFCV-52+  [LFCV-52+_LPF_v2]
FL9  LFCV-52+  [LFCV-52+_LPF_v2]
FL10  LFCV-52+  [LFCV-52+_LPF_v2]
FL11  LFCV-52+  [LFCV-52+_LPF_v2]
FL12  LFCV-52+  [LFCV-52+_LPF_v2]
FL13  LFCV-52+  [LFCV-52+_LPF_v2]
FL14  LFCV-52+  [LFCV-52+_LPF_v2]
FL15  LFCV-52+  [LFCV-52+_LPF_v2]
FL16  LFCV-52+  [LFCV-52+_LPF_v2]
IC3  LMS7002M  [LMS7002M_v5]  (parts A,B of 7)
IC4  CAT24C128WI-GT3  [SOIC127P600-8DL_v2]
R14  49.9R  [RES0402]
R15  0R  [RES0402]
R16  49.9R  [RES0402]
R17  100R, 1%  [RES0402]
R18  0R  [RES0402]
R19  0R  [RES0402]
R20  0R  [RES0402]
R21  0R  [RES0402]
R22  10k, 1%  [RES0402]
R23  49.9R  [RES0402]
R24  49.9R  [RES0402]
R25  0R  [RES0402]
R26  100R, 1%  [RES0402]
R27  10k, 1%  [RES0402]
R28  0R  [RES0402]
R29  10k, 1%  [RES0402]
R30  0R  [RES0402]
R31  10k, 1%  [RES0402]
R32  0R  [RES0402]
R33  10k, 1%  [RES0402]
R34  0R  [RES0402]
R35  49.9R  [RES0402]
R36  39R, 1%  [RES0402]
R37  49.9R  [RES0402]
R38  100R, 1%  [RES0402]
R39  39R, 1%  [RES0402]
R40  39R, 1%  [RES0402]
R41  49.9R, 1%  [RES0402]
R42  39R, 1%  [RES0402]
R43  49.9R, 1%  [RES0402]
R44  49.9R, 1%  [RES0402]
R45  49.9R, 1%  [RES0402]
R46  0R  [RES0402]
R47  49.9R  [RES0402]
R48  10k, 1%  [RES0402]
R49  49.9R  [RES0402]
R50  39R, 1%  [RES0402]
R51  100R, 1%  [RES0402]
R52  39R, 1%  [RES0402]
R53  39R, 1%  [RES0402]
R54  39R, 1%  [RES0402]
R55  10k, 1%  [RES0402]
R56  2k2, 1%  [RES0402]
R57  2k2, 1%  [RES0402]

### Nets
GND: C3.2 C4.2 FL1.2(GND) FL1.4(GND) FL2.2(GND) FL2.4(GND) FL3.2(GND) FL3.4(GND) FL4.2(GND) FL4.4(GND) FL5.2(GND) FL5.4(GND) FL6.2(GND) FL6.4(GND) FL7.2(GND) FL7.4(GND) FL8.2(GND) FL8.4(GND) FL9.2(GND) FL9.4(GND) FL10.2(GND) FL10.4(GND) FL11.2(GND) FL11.4(GND) FL12.2(GND) FL12.4(GND) FL13.2(GND) FL13.4(GND) FL14.2(GND) FL14.4(GND) FL15.2(GND) FL15.4(GND) FL16.2(GND) FL16.4(GND) IC3.V30(LOGIC_RESET) IC4.1(A0) IC4.2(A1) IC4.3(A2) IC4.4(VSS) IC4.7(WP) R14.2 R16.2 R23.2 R24.2 R34.1 R35.2 R37.2 R47.2 R48.1 R49.2 R55.2
VDIO_LMS: C4.1 IC4.8(VCC) R22.2 R27.2 R29.1 R31.1 R33.2 R56.1 R57.1
FPGA_SPI0_LMS2_MISO: R44.2
FPGA_SPI0_LMS2_SS: R45.2
FPGA_SPI0_MOSI: R43.2
FPGA_SPI0_SCLK: R41.2
LMS2_CORE_LDO_EN: IC3.U33(CORE_LDO_EN) R33.1 R34.2
LMS2_I2C_SCL: IC3.C27(SCL) IC4.6(SCL) R56.2
LMS2_I2C_SDA: IC3.D26(SDA) IC4.5(SDA) R57.2
LMS2_IC_RX1_BB_I_N: FL10.1(RF_IN) R39.2
LMS2_IC_RX1_BB_I_P: FL9.1(RF_IN) R36.2
LMS2_IC_RX1_BB_Q_N: FL12.1(RF_IN) R42.2
LMS2_IC_RX1_BB_Q_P: FL11.1(RF_IN) R40.2
LMS2_IC_RX2_BB_I_N: FL14.1(RF_IN) R52.2
LMS2_IC_RX2_BB_I_P: FL13.1(RF_IN) R50.2
LMS2_IC_RX2_BB_Q_N: FL16.1(RF_IN) R54.2
LMS2_IC_RX2_BB_Q_P: FL15.1(RF_IN) R53.2
LMS2_IC_TX1_BB_I_N: FL2.3(RF_OUT) R16.1 R17.2 R18.2
LMS2_IC_TX1_BB_I_P: FL1.3(RF_OUT) R14.1 R15.2 R17.1
LMS2_IC_TX1_BB_Q_N: FL4.3(RF_OUT) R21.2 R24.1 R26.2
LMS2_IC_TX1_BB_Q_P: FL3.3(RF_OUT) R19.2 R23.1 R26.1
LMS2_IC_TX2_BB_I_N: FL6.3(RF_OUT) R28.2 R37.1 R38.2
LMS2_IC_TX2_BB_I_P: FL5.3(RF_OUT) R25.2 R35.1 R38.1
LMS2_IC_TX2_BB_Q_N: FL8.3(RF_OUT) R32.2 R49.1 R51.2
LMS2_IC_TX2_BB_Q_P: FL7.3(RF_OUT) R30.2 R47.1 R51.1
LMS2_RESET: IC3.E27(RESET) R27.1
LMS2_RX1_BB_I_N: FL10.3(RF_OUT)
LMS2_RX1_BB_I_P: FL9.3(RF_OUT)
LMS2_RX1_BB_Q_N: FL12.3(RF_OUT)
LMS2_RX1_BB_Q_P: FL11.3(RF_OUT)
LMS2_RX2_BB_I_N: FL14.3(RF_OUT)
LMS2_RX2_BB_I_P: FL13.3(RF_OUT)
LMS2_RX2_BB_Q_N: FL16.3(RF_OUT)
LMS2_RX2_BB_Q_P: FL15.3(RF_OUT)
LMS2_RXEN: IC3.V34(RXEN) R31.2
LMS2_RxPLL_CLK: IC3.AM24(xoscin_rx)
LMS2_TX1_BB_I_N: FL2.1(RF_IN)
LMS2_TX1_BB_I_P: FL1.1(RF_IN)
LMS2_TX1_BB_Q_N: FL4.1(RF_IN)
LMS2_TX1_BB_Q_P: FL3.1(RF_IN)
LMS2_TX2_BB_I_N: FL6.1(RF_IN)
LMS2_TX2_BB_I_P: FL5.1(RF_IN)
LMS2_TX2_BB_Q_N: FL8.1(RF_IN)
LMS2_TX2_BB_Q_P: FL7.1(RF_IN)
LMS2_TXEN: IC3.U29(TXEN) R29.2
LMS2_TxPLL_CLK: IC3.E5(xoscin_tx)
NetC3_1: C3.1 IC3.C29(SCLK) R41.1
NetIC3_AA5: IC3.AA5(rbbqn_pad_1) R42.1
NetIC3_AA33: IC3.AA33(FCLK1) R20.2
NetIC3_AB2: IC3.AB2(rbbin_pad_1) R39.1
NetIC3_AB4: IC3.AB4(rbbqp_pad_1) R40.1
NetIC3_AB6: IC3.AB6(rbbqn_pad_2) R54.1
NetIC3_AB34: IC3.AB34(MCLK1) R20.1
NetIC3_AC3: IC3.AC3(rbbin_pad_2) R52.1
NetIC3_AC5: IC3.AC5(rbbqp_pad_2) R53.1
NetIC3_AD2: IC3.AD2(rbbip_pad_2) R50.1
NetIC3_D28: IC3.D28(SEN) R45.1
NetIC3_F18: IC3.F18(vr_rext) R55.1
NetIC3_F28: IC3.F28(SDO) R44.1
NetIC3_F30: IC3.F30(SDIO) R43.1
NetIC3_P2: IC3.P2(tbbqn_pad_1) R21.1
NetIC3_P34: IC3.P34(MCLK2) R46.1
NetIC3_R3: IC3.R3(tbbqp_pad_1) R19.1
NetIC3_R5: IC3.R5(tbbin_pad_1) R18.1
NetIC3_R29: IC3.R29(FCLK2) R46.2
NetIC3_T4: IC3.T4(tbbip_pad_1) R15.1
NetIC3_T6: IC3.T6(tbbin_pad_2) R28.1
NetIC3_U1: IC3.U1(tbbqn_pad_2) R32.1
NetIC3_U3: IC3.U3(tbbqp_pad_2) R30.1
NetIC3_U31: IC3.U31(TXNRX2) R48.2
NetIC3_V2: IC3.V2(tbbip_pad_2) R25.1
NetIC3_V32: IC3.V32(TXNRX1) R22.1
NetIC3_Y6: IC3.Y6(rbbip_pad_1) R36.1

Not connected (* = marked no-connect by the designer): IC3 AA1(adcin_ip_2)* AA3(adcin_qp_2)* AB30(DIQ1_D10)* AB32(DIQ1_D11)* AC29(DIQ1_D5)* AC31(DIQ1_D8)* AC33(DIQ1_D9)* AD30(DIQ1_D4)* AD32(DIQ1_D7)* AE31(DIQ1_D3)* AE33(DIQ1_D6)* AF30(DIQ1_D1)* AF34(DIQ1_D2)* AG31(DIQ1_D0)* B22(tstao)* D22(tstdo<0>)* F22(tstdo<1>)* H30(DIQ2_D0)* J31(DIQ2_D1)* K30(DIQ2_D2)* K32(DIQ2_D3)* K34(DIQ2_D5)* L31(DIQ2_D4)* M30(DIQ2_D6)* M32(DIQ2_D7)* N31(DIQ2_D8)* N33(DIQ2_D9)* P30(DIQ2_D10)* P32(DIQ2_D11)* R33(ENABLE_IQSEL2)* U5(adcin_in_1)* V4(adcin_ip_1)* V6(adcin_in_2)* W3(adcin_qn_1)* Y2(adcin_qp_1)* Y4(adcin_qn_2)* Y32(ENABLE_IQSEL1)*

### Layout directives
net class CLK_PATH: LMS2_RxPLL_CLK, LMS2_TxPLL_CLK
net class FPGA_SPI0: FPGA_SPI0_LMS2_MISO, FPGA_SPI0_LMS2_SS, FPGA_SPI0_MOSI, FPGA_SPI0_SCLK
net class LMS2_I2C: LMS2_I2C_SCL, LMS2_I2C_SDA
net class LMS2_MISC: LMS2_CORE_LDO_EN, LMS2_RESET, LMS2_RXEN, LMS2_TXEN
differential pair: LMS2_IC_RX1_BB_I_N, LMS2_IC_RX1_BB_I_P, LMS2_IC_RX1_BB_Q_N, LMS2_IC_RX1_BB_Q_P, LMS2_IC_RX2_BB_I_N, LMS2_IC_RX2_BB_I_P, LMS2_IC_RX2_BB_Q_N, LMS2_IC_RX2_BB_Q_P, LMS2_IC_TX1_BB_I_N, LMS2_IC_TX1_BB_I_P, LMS2_IC_TX1_BB_Q_N, LMS2_IC_TX1_BB_Q_P, LMS2_IC_TX2_BB_I_N, LMS2_IC_TX2_BB_I_P, LMS2_IC_TX2_BB_Q_N, LMS2_IC_TX2_BB_Q_P
net class LMS2_BB: GND, LMS2_IC_RX1_BB_I_N, LMS2_IC_RX1_BB_I_P, LMS2_IC_RX1_BB_Q_N, LMS2_IC_RX1_BB_Q_P, LMS2_IC_RX2_BB_I_N, LMS2_IC_RX2_BB_I_P, LMS2_IC_RX2_BB_Q_N, LMS2_IC_RX2_BB_Q_P, LMS2_IC_TX1_BB_I_N, LMS2_IC_TX1_BB_I_P, LMS2_IC_TX1_BB_Q_N, LMS2_IC_TX1_BB_Q_P, LMS2_IC_TX2_BB_I_N, LMS2_IC_TX2_BB_I_P, LMS2_IC_TX2_BB_Q_N, LMS2_IC_TX2_BB_Q_P, LMS2_RX1_BB_I_N, LMS2_RX1_BB_I_P, LMS2_RX1_BB_Q_N, LMS2_RX1_BB_Q_P, LMS2_RX2_BB_I_N, LMS2_RX2_BB_I_P, LMS2_RX2_BB_Q_N, LMS2_RX2_BB_Q_P, LMS2_TX1_BB_I_N, LMS2_TX1_BB_I_P, LMS2_TX1_BB_Q_N, LMS2_TX1_BB_Q_P, LMS2_TX2_BB_I_N, LMS2_TX2_BB_I_P, LMS2_TX2_BB_Q_N, LMS2_TX2_BB_Q_P

### Notes on the sheet
- NF elements on sheet: -
- Number of NF elements on sheet: 0
- LMS7002M misc
- LMS2_ (5G)
- Digital interfaces
- (near FL1) TX BB LPFs
- Baseband external IO
- (near IC3) PCB note: I and Q path lengths must match
- (near R33) CORE_LDO_EN:
  0: internal regulators disabled
  1: internal regulators enabled
- LimeLight interface is not used.
  External BB DACs and ADCs are used.
- RX BB LPFs
- (near IC4) I2C Address: [1 0 1 0 0 0 0 RW]
- LMS2 EEPROM
- Project name:
- Title:
- Size:
- Date:
- A3
- Revision:
- Time:
- Sheet
- of
- File:
- (in symbol LMS7002Mr4, part A) LMS7002M Digital; Part 1/7; PLL CLOCK IN; PORT1; MISC; SPI; PORT2; I2C; TEST PINS; 10k reference resistor
- (in symbol LMS7002Mr4, part B) LMS7002M Baseband; Part 2/7

### Library data of the parts
C3 = Cap_0402: as C1 on sheet 05_LMS1_Misc; Value: 10pF, 25V; Supplier 1: Farnell; Supplier Part Number 1: 2332478RL; Product Range: -; RoHS: YES; Operating Temperature Min: -55; Operating Temperature Max: 125; Capacitance Tolerance ±: ± 5%; MSL: MSL 1 - Unlimited; Packaging: Cut Tape
C4 = Cap_0402: as C2 on sheet 05_LMS1_Misc; Value: 1uF, 10V; Supplier 1: Digi-Key; Supplier Part Number 1: 445-9066-1-ND; MSL: -; RoHS: YES
FL1-FL16 = LFCV-52+_LPF: Manufacturer: Mini Circuits; Part Description: Ceramic Low Pass Filter, 50Ω, DC to 52 MHz; Manufacturer Part Number 1: LFCV-52+; Supplier Part Number 1: LFCV-52+; Supplier 1: Mini Circuits
IC3 = LMS7002Mr4: as IC1 on sheet 05_LMS1_Misc; Supplier 1: Lime Microsystems; Supplier Part Number 1: LMS7002M; Manufacturer Part Number 1: LMS7002M
IC4 = 24FC64F: as IC2 on sheet 05_LMS1_Misc; Supplier 1: Digi-Key; Supplier Part Number 1: CAT24C128WI-GT3CT-ND; Manufacturer Part Number 1: CAT24C128WI-GT3; RoHS: RoHS Compliant; Category: Integrated Circuits (ICs); Stock 1: 14804; Pricing 1: 1=0.31, 10=0.309, 100=0.2532, 500=0.24616, 1000=0.23956 (USD); Packaging: Cut Tape (CT); Part Status: Active; Technology: EEPROM; Operating Temperature: -40°C ~ 85°C (TA); Mounting Type: Surface Mount; Package / Case: 8-SOIC (0.154", 3.90mm Width); Supplier Device Package: 8-SOIC; Base Part Number: CAT24C128; ComponentLink1URL: http://www.onsemi.com/pub/Collateral/CAT24C128-D.PDF; ComponentLink1Description: http://www.onsemi.com/pub/Collateral/CAT24C128-D.PDF
R14 R16 R23 R24 R35 R37 R47 R49 = Res_0402: Manufacturer: Samsung Electro-Mechanics America, Inc.; Part Description: RES SMD 49.9 OHM 1% 1/16W 0402; Manufacturer Part Number 1: RC1005F49R9CS; Temperature Coefficient: ±100ppm/°C; Resistance (Ohms): 49.9; Tolerance: ±1%; Power (Watts): 0.063W, 1/16W; Number of Terminations: 2; Size / Dimension: 0.039" L x 0.020" W (1.00mm x 0.50mm); Supplier Device Package: 0402 (1005 Metric); RoHS: RoHS Compliant; Supplier Part Number 1: 1276-3469-6-ND; Features: -; Packaging: Digi-Reel®; Height: 0.016" (0.40mm); Category: Resistors; Composition: Thick Film; Package / Case: 0402 (1005 Metric); Supplier 1: Digi-Key; Operating Temperature: -55°C ~ 155°C; Value: 49.9R
R15 R18 R19 R21 R25 R28 R30 R32 = Res_0402: Manufacturer: Yageo; Part Description: RES SMD 0.0OHM JUMPER 1/16W 0402; Manufacturer Part Number 1: RC0402JR-070RL; Supplier 1: Digi-Key; Supplier Part Number 1: 311-0.0JRTR-ND; Composition: Thick Film; Package / Case: 0402 (1005 Metric); Category: Resistors; Value: 0R
R17 R26 R38 R51 = Res_0402: Manufacturer Part Number 1: RMCF0402FT100R; Manufacturer: Stackpole Electronics Inc.; Part Description: RES SMD 100 OHM 1% 1/16W 0402; Power (Watts): 0.063W, 1/16W; Temperature Coefficient: ±100ppm/°C; Resistance (Ohms): 100; Value: 100R, 1%; Supplier 1: Digi-Key; Supplier Part Number 1: RMCF0402FT100RDKR-ND; Packaging: Digi-Reel®; Composition: Thick Film; Number of Terminations: 2; Package / Case: 0402 (1005 Metric); RoHS: RoHS Compliant; Category: Resistors; Size / Dimension: 0.039" L x 0.020" W (1.00mm x 0.50mm); Tolerance: ±1%; Supplier Device Package: 0402; Features: -; Height: 0.016" (0.40mm); Operating Temperature: -55°C ~ 155°C
R20 R34 R46 = Res_0402: Manufacturer Part Number 1: RC0402JR-070RL; Manufacturer: Yageo; Part Description: RES SMD 0.0OHM JUMPER 1/16W 0402; Resistance (Ohms): 0.0; Tolerance: Jumper; Power (Watts): 0.063W, 1/16W; Value: 0R; Supplier 1: Digi-Key; Supplier Part Number 1: 311-0.0JRTR-ND; Category: Resistors; Temperature Coefficient: -; Features: Moisture Resistant; Supplier Device Package: 0402; Height: 0.016" (0.40mm); Package / Case: 0402 (1005 Metric); Operating Temperature: -55°C ~ 155°C; Size / Dimension: 0.039" L x 0.020" W (1.00mm x 0.50mm); Composition: Thick Film; Packaging: Tape & Reel (TR); Number of Terminations: 2; RoHS: RoHS Compliant
R22 R27 R29 R31 R33 R48 R55 = Res_0402: as R1 on sheet 05_LMS1_Misc; Value: 10k, 1%; Supplier 1: Digi-Key; Supplier Part Number 1: 311-10.0KLRTR-ND; Resistance (Ohms): 10k; Packaging: Tape & Reel (TR); RoHS: RoHS Compliant; Package / Case: 0402 (1005 Metric); Tolerance: ±1%; Operating Temperature: -55°C ~ 155°C; Size / Dimension: 0.039" L x 0.020" W (1.00mm x 0.50mm); Number of Terminations: 2; Category: Resistors; Height: 0.016" (0.40mm); Supplier Device Package: 0402; Features: Moisture Resistant; Composition: Thick Film
R36 R39 R40 R42 R50 R52-R54 = Res_0402: Manufacturer: Yageo; Manufacturer Part Number 1: RC0402FR-0739RL; Part Description: 39 Ohms ±1% 0.063W, 1/16W Chip Resistor 0402 (1005 Metric) Moisture Resistant Thick Film; Power Rating: 63mW; Voltage Rating: 50V; Temperature Coefficient: 100ppm/°C; Value: 39R, 1%; ComponentLink1URL: http://www.yageo.com.tw/exep/pages/download/literatures/PYu-R_INT-thick_7.pdf?src-supplier=Digi-Key; ComponentLink1Description: http://www.yageo.com.tw/exep/pages/download/literatures/PYu-R_INT-thick_7.pdf?src-supplier=Digi-Key; ComponentLink2URL: http://www.yageo.com/NewPortal/yageodocoutput?fileName=/pdf/R-Chip/PYu-RC_51_RoHS_P_0.pdf&src-supplier=Digi-Key; ComponentLink2Description: http://www.yageo.com/NewPortal/yageodocoutput?fileName=/pdf/R-Chip/PYu-RC_51_RoHS_P_0.pdf&src-supplier=Digi-Key; Supplier 1: Digi-Key; Supplier Part Number 1: 311-39.0LRCT-ND; Stock 1: 1060646; Pricing 1: 1=0,10000, 10=0,01600, 100=0,00660, 1000=0,00299, 2500=0,00259, 5000=0,00214 (USD); RoHS: Yes; Case/Package: 0402; Case Code (Imperial): 0402; Case Code (Metric): 1005; Weight: 2.3E-05oz; Contact Plating: Tin,Matte; Min Operating Temperature: -55°C; Max Operating Temperature: 155°C; Tolerance: 1%; Package Quantity: 1; Packaging: Tape and Reel; Features: Moisture Resistant; Resistance: 39R; Termination: SMD/SMT; Resistor Type: Thick Film; Number of Terminations: 2; Max Power Dissipation: 63mW; Working Voltage: 50V; Series: RC; Resistance Tolerance: 1%; Construction: Rectangular; Technology: THICK FILM; Length: 1mm; Width: 0.5mm; Height: 0.016inch; Depth: 0.5mm; Radiation Hardening: No; Lead Free: Lead Free; REACH SVHC: Unknown; Military Standard: Not; RoHS Compliant: Yes; ComponentLink3URL: https://datasheet.ciiva.com/11819/0900766b80c66297-11819479.pdf?src-supplier=RSComponents; ComponentLink3Description: https://datasheet.ciiva.com/11819/0900766b80c66297-11819479.pdf?src-supplier=RSComponents; ComponentLink4URL: https://datasheet.ciiva.com/2519/pyu-r-int-thick-7-2519001.pdf?src-supplier=Digi-Key; ComponentLink4Description: https://datasheet.ciiva.com/2519/pyu-r-int-thick-7-2519001.pdf?src-supplier=Digi-Key; ComponentLink5URL: https://datasheet.ciiva.com/2519/pyu-r-int-thick-7-2519002.pdf?src-supplier=Digi-Key; ComponentLink5Description: https://datasheet.ciiva.com/2519/pyu-r-int-thick-7-2519002.pdf?src-supplier=Digi-Key; ComponentLink6URL: https://datasheet.ciiva.com/2519/pyu-r-int-thick-7-2519000.pdf?src-supplier=Digi-Key; ComponentLink6Description: https://datasheet.ciiva.com/2519/pyu-r-int-thick-7-2519000.pdf?src-supplier=Digi-Key; ComponentLink7URL: https://datasheet.ciiva.com/7849/1018594-7849983.pdf?src-supplier=Element14; ComponentLink7Description: https://datasheet.ciiva.com/7849/1018594-7849983.pdf?src-supplier=Element14; ComponentLink8URL: https://datasheet.ciiva.com/7849/1018594-7849982.pdf?src-supplier=Element14; ComponentLink8Description: https://datasheet.ciiva.com/7849/1018594-7849982.pdf?src-supplier=Element14; ComponentLink9URL: https://datasheet.ciiva.com/8889/pyu-rc0402-51-rohs-l-6-8889306.pdf?src-supplier=Avnet; ComponentLink9Description: https://datasheet.ciiva.com/8889/pyu-rc0402-51-rohs-l-6-8889306.pdf?src-supplier=Avnet; ComponentLink10URL: https://datasheet.ciiva.com/16741/pyu-rc0402-51-rohs-l-6-r-16741016.pdf?src-supplier=Future+Electronics; ComponentLink10Description: https://datasheet.ciiva.com/16741/pyu-rc0402-51-rohs-l-6-r-16741016.pdf?src-supplier=Future+Electronics; ComponentLink11URL: https://datasheet.ciiva.com/15189/getdatasheetpartid-325130-15189445.pdf?src-supplier=Verical; ComponentLink11Description: https://datasheet.ciiva.com/15189/getdatasheetpartid-325130-15189445.pdf?src-supplier=Verical
R41 R43-R45 = Res_0402: as R6 on sheet 05_LMS1_Misc; Number of Terminations: 2; Size / Dimension: 0.039" L x 0.020" W (1.00mm x 0.50mm); Supplier Device Package: 0402 (1005 Metric); RoHS: RoHS Compliant; Supplier Part Number 1: 1276-3469-6-ND; Features: -; Packaging: Digi-Reel®; Tolerance: ±1%; Height: 0.016" (0.40mm); Category: Resistors; Composition: Thick Film; Package / Case: 0402 (1005 Metric); Supplier 1: Digi-Key; Operating Temperature: -55°C ~ 155°C; Value: 49.9R, 1%; Manufacturer Part Number 1: RC1005F49R9CS
R56 R57 = Res_0402: as R12 on sheet 05_LMS1_Misc; Value: 2k2, 1%; Supplier 1: Digi-Key; Supplier Part Number 1: RMCF0402FT2K20CT-ND; Supplier Device Package: 0402; Package / Case: 0402 (1005 Metric); Size / Dimension: 0.039" L x 0.020" W (1.00mm x 0.50mm); Operating Temperature: -55°C ~ 155°C; Composition: Thick Film; Category: Resistors; Features: -; Height: 0.016" (0.40mm); RoHS: RoHS Compliant; Number of Terminations: 2; Packaging: Cut Tape (CT); Tolerance: ±1%

## Sheet 07_LMS3_Misc.SchDoc: LMS7002M misc (LMS1)
size A3; Organization: Lime Microsystems; Address1: Surrey Tech Centre; Address2: Guildford GU2 7YG; Address3: Surrey; Address4: United Kingdom; Revision: v1.0; SheetNumber: 7; SheetTotal: 31
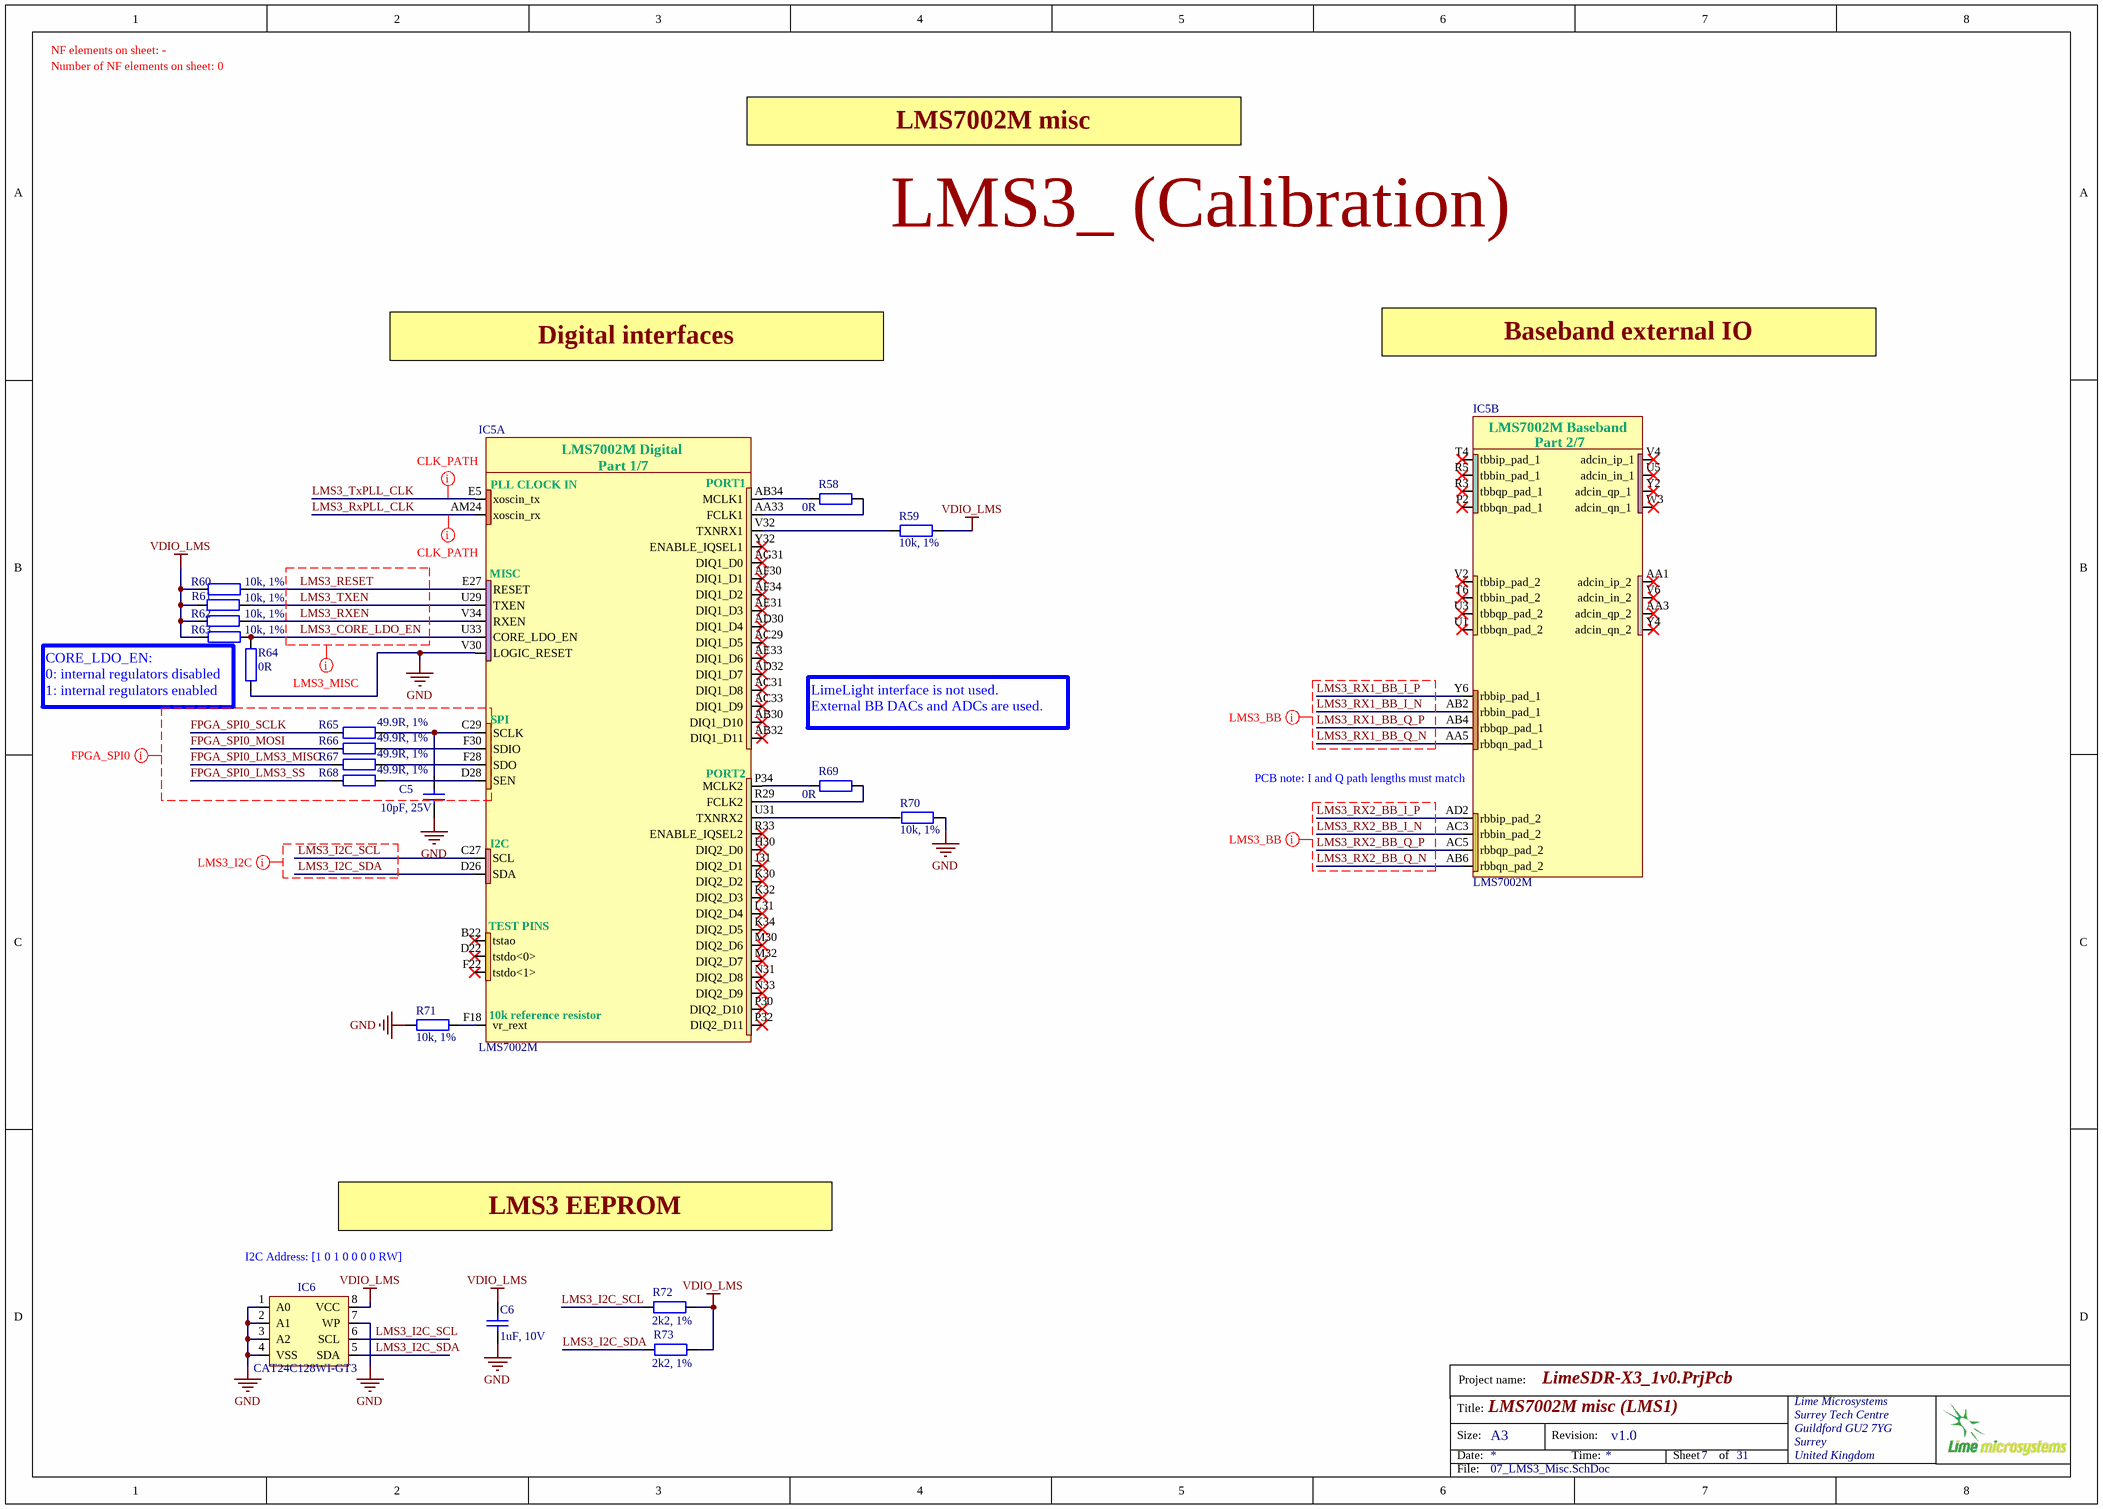
[diagram p6: 07_LMS3_Misc.SchDoc]

### Parts
C5  10pF, 25V  [CAP0402]
C6  1uF, 10V  [CAP0402]
IC5  LMS7002M  [LMS7002M_v5]  (parts A,B of 7)
IC6  CAT24C128WI-GT3  [SOIC127P600-8DL_v2]
R58  0R  [RES0402]
R59  10k, 1%  [RES0402]
R60  10k, 1%  [RES0402]
R61  10k, 1%  [RES0402]
R62  10k, 1%  [RES0402]
R63  10k, 1%  [RES0402]
R64  0R  [RES0402]
R65  49.9R, 1%  [RES0402]
R66  49.9R, 1%  [RES0402]
R67  49.9R, 1%  [RES0402]
R68  49.9R, 1%  [RES0402]
R69  0R  [RES0402]
R70  10k, 1%  [RES0402]
R71  10k, 1%  [RES0402]
R72  2k2, 1%  [RES0402]
R73  2k2, 1%  [RES0402]

### Nets
GND: C5.2 C6.2 IC5.V30(LOGIC_RESET) IC6.1(A0) IC6.2(A1) IC6.3(A2) IC6.4(VSS) IC6.7(WP) R64.1 R70.1 R71.2
VDIO_LMS: C6.1 IC6.8(VCC) R59.2 R60.2 R61.1 R62.1 R63.2 R72.1 R73.1
FPGA_SPI0_LMS3_MISO: R67.2
FPGA_SPI0_LMS3_SS: R68.2
FPGA_SPI0_MOSI: R66.2
FPGA_SPI0_SCLK: R65.2
LMS3_CORE_LDO_EN: IC5.U33(CORE_LDO_EN) R63.1 R64.2
LMS3_I2C_SCL: IC5.C27(SCL) IC6.6(SCL) R72.2
LMS3_I2C_SDA: IC5.D26(SDA) IC6.5(SDA) R73.2
LMS3_RESET: IC5.E27(RESET) R60.1
LMS3_RX1_BB_I_N: IC5.AB2(rbbin_pad_1)
LMS3_RX1_BB_I_P: IC5.Y6(rbbip_pad_1)
LMS3_RX1_BB_Q_N: IC5.AA5(rbbqn_pad_1)
LMS3_RX1_BB_Q_P: IC5.AB4(rbbqp_pad_1)
LMS3_RX2_BB_I_N: IC5.AC3(rbbin_pad_2)
LMS3_RX2_BB_I_P: IC5.AD2(rbbip_pad_2)
LMS3_RX2_BB_Q_N: IC5.AB6(rbbqn_pad_2)
LMS3_RX2_BB_Q_P: IC5.AC5(rbbqp_pad_2)
LMS3_RXEN: IC5.V34(RXEN) R62.2
LMS3_RxPLL_CLK: IC5.AM24(xoscin_rx)
LMS3_TXEN: IC5.U29(TXEN) R61.2
LMS3_TxPLL_CLK: IC5.E5(xoscin_tx)
NetC5_1: C5.1 IC5.C29(SCLK) R65.1
NetIC5_AA33: IC5.AA33(FCLK1) R58.2
NetIC5_AB34: IC5.AB34(MCLK1) R58.1
NetIC5_D28: IC5.D28(SEN) R68.1
NetIC5_F18: IC5.F18(vr_rext) R71.1
NetIC5_F28: IC5.F28(SDO) R67.1
NetIC5_F30: IC5.F30(SDIO) R66.1
NetIC5_P34: IC5.P34(MCLK2) R69.1
NetIC5_R29: IC5.R29(FCLK2) R69.2
NetIC5_U31: IC5.U31(TXNRX2) R70.2
NetIC5_V32: IC5.V32(TXNRX1) R59.1

Not connected (* = marked no-connect by the designer): IC5 AA1(adcin_ip_2_)* AA3(adcin_qp_2_)* AB30(DIQ1_D10)* AB32(DIQ1_D11)* AC29(DIQ1_D5)* AC31(DIQ1_D8)* AC33(DIQ1_D9)* AD30(DIQ1_D4)* AD32(DIQ1_D7)* AE31(DIQ1_D3)* AE33(DIQ1_D6)* AF30(DIQ1_D1)* AF34(DIQ1_D2)* AG31(DIQ1_D0)* B22(tstao)* D22(tstdo<0>)* F22(tstdo<1>)* H30(DIQ2_D0)* J31(DIQ2_D1)* K30(DIQ2_D2)* K32(DIQ2_D3)* K34(DIQ2_D5)* L31(DIQ2_D4)* M30(DIQ2_D6)* M32(DIQ2_D7)* N31(DIQ2_D8)* N33(DIQ2_D9)* P2(tbbqn_pad_1)* P30(DIQ2_D10)* P32(DIQ2_D11)* R3(tbbqp_pad_1)* R5(tbbin_pad_1)* R33(ENABLE_IQSEL2)* T4(tbbip_pad_1)* T6(tbbin_pad_2)* U1(tbbqn_pad_2)* U3(tbbqp_pad_2)* U5(adcin_in_1)* V2(tbbip_pad_2)* V4(adcin_ip_1)* V6(adcin_in_2_)* W3(adcin_qn_1_)* Y2(adcin_qp_1_)* Y4(adcin_qn_2_)* Y32(ENABLE_IQSEL1)*

### Layout directives
net class CLK_PATH: LMS3_RxPLL_CLK, LMS3_TxPLL_CLK
net class FPGA_SPI0: FPGA_SPI0_LMS3_MISO, FPGA_SPI0_LMS3_SS, FPGA_SPI0_MOSI, FPGA_SPI0_SCLK
net class LMS3_I2C: LMS3_I2C_SCL, LMS3_I2C_SDA
net class LMS3_MISC: LMS3_CORE_LDO_EN, LMS3_RESET, LMS3_RXEN, LMS3_TXEN
net class LMS3_BB: LMS3_RX1_BB_I_N, LMS3_RX1_BB_I_P, LMS3_RX1_BB_Q_N, LMS3_RX1_BB_Q_P, LMS3_RX2_BB_I_N, LMS3_RX2_BB_I_P, LMS3_RX2_BB_Q_N, LMS3_RX2_BB_Q_P

### Notes on the sheet
- NF elements on sheet: -
- Number of NF elements on sheet: 0
- LMS7002M misc
- LMS3_ (Calibration)
- Digital interfaces
- Baseband external IO
- (near R63) CORE_LDO_EN:
  0: internal regulators disabled
  1: internal regulators enabled
- LimeLight interface is not used.
  External BB DACs and ADCs are used.
- (near IC5) PCB note: I and Q path lengths must match
- (near IC6) I2C Address: [1 0 1 0 0 0 0 RW]
- LMS3 EEPROM
- Project name:
- Title:
- Size:
- Date:
- A3
- Revision:
- Time:
- Sheet
- of
- File:
- (in symbol LMS7002Mr4, part A) LMS7002M Digital; Part 1/7; PLL CLOCK IN; PORT1; MISC; SPI; PORT2; I2C; TEST PINS; 10k reference resistor
- (in symbol LMS7002Mr4, part B) LMS7002M Baseband; Part 2/7

### Library data of the parts
C5 = Cap_0402: as C1 on sheet 05_LMS1_Misc; Value: 10pF, 25V; Supplier 1: Farnell; Supplier Part Number 1: 2332478RL; Product Range: -; RoHS: YES; Operating Temperature Min: -55; Operating Temperature Max: 125; Capacitance Tolerance ±: ± 5%; MSL: MSL 1 - Unlimited; Packaging: Cut Tape
C6 = Cap_0402: as C2 on sheet 05_LMS1_Misc; Value: 1uF, 10V; Supplier 1: Digi-Key; Supplier Part Number 1: 445-9066-1-ND; MSL: -; RoHS: YES
IC5 = LMS7002Mr4: as IC1 on sheet 05_LMS1_Misc; Supplier 1: Lime Microsystems; Supplier Part Number 1: LMS7002M; Manufacturer Part Number 1: LMS7002M
IC6 = 24FC64F: as IC2 on sheet 05_LMS1_Misc; Supplier 1: Digi-Key; Supplier Part Number 1: CAT24C128WI-GT3CT-ND; Manufacturer Part Number 1: CAT24C128WI-GT3; RoHS: RoHS Compliant; Category: Integrated Circuits (ICs); Stock 1: 14804; Pricing 1: 1=0.31, 10=0.309, 100=0.2532, 500=0.24616, 1000=0.23956 (USD); Packaging: Cut Tape (CT); Part Status: Active; Technology: EEPROM; Operating Temperature: -40°C ~ 85°C (TA); Mounting Type: Surface Mount; Package / Case: 8-SOIC (0.154", 3.90mm Width); Supplier Device Package: 8-SOIC; Base Part Number: CAT24C128; ComponentLink1URL: http://www.onsemi.com/pub/Collateral/CAT24C128-D.PDF; ComponentLink1Description: http://www.onsemi.com/pub/Collateral/CAT24C128-D.PDF
R58 R64 R69 = Res_0402: as R20 on sheet 06_LMS2_Misc; Value: 0R; Supplier 1: Digi-Key; Supplier Part Number 1: 311-0.0JRTR-ND; Category: Resistors; Temperature Coefficient: -; Features: Moisture Resistant; Supplier Device Package: 0402; Height: 0.016" (0.40mm); Package / Case: 0402 (1005 Metric); Operating Temperature: -55°C ~ 155°C; Size / Dimension: 0.039" L x 0.020" W (1.00mm x 0.50mm); Composition: Thick Film; Packaging: Tape & Reel (TR); Number of Terminations: 2; RoHS: RoHS Compliant
R59-R63 R70 R71 = Res_0402: as R1 on sheet 05_LMS1_Misc; Value: 10k, 1%; Supplier 1: Digi-Key; Supplier Part Number 1: 311-10.0KLRTR-ND; Resistance (Ohms): 10k; Packaging: Tape & Reel (TR); RoHS: RoHS Compliant; Package / Case: 0402 (1005 Metric); Tolerance: ±1%; Operating Temperature: -55°C ~ 155°C; Size / Dimension: 0.039" L x 0.020" W (1.00mm x 0.50mm); Number of Terminations: 2; Category: Resistors; Height: 0.016" (0.40mm); Supplier Device Package: 0402; Features: Moisture Resistant; Composition: Thick Film
R65-R68 = Res_0402: as R6 on sheet 05_LMS1_Misc; Number of Terminations: 2; Size / Dimension: 0.039" L x 0.020" W (1.00mm x 0.50mm); Supplier Device Package: 0402 (1005 Metric); RoHS: RoHS Compliant; Supplier Part Number 1: 1276-3469-6-ND; Features: -; Packaging: Digi-Reel®; Tolerance: ±1%; Height: 0.016" (0.40mm); Category: Resistors; Composition: Thick Film; Package / Case: 0402 (1005 Metric); Supplier 1: Digi-Key; Operating Temperature: -55°C ~ 155°C; Value: 49.9R, 1%; Manufacturer Part Number 1: RC1005F49R9CS
R72 R73 = Res_0402: as R12 on sheet 05_LMS1_Misc; Value: 2k2, 1%; Supplier 1: Digi-Key; Supplier Part Number 1: RMCF0402FT2K20CT-ND; Supplier Device Package: 0402; Package / Case: 0402 (1005 Metric); Size / Dimension: 0.039" L x 0.020" W (1.00mm x 0.50mm); Operating Temperature: -55°C ~ 155°C; Composition: Thick Film; Category: Resistors; Features: -; Height: 0.016" (0.40mm); RoHS: RoHS Compliant; Number of Terminations: 2; Packaging: Cut Tape (CT); Tolerance: ±1%